# Altium project S7V30V2.PrjPCB (part 2 of 2)

## Sheet Shett_3.SchDoc
size A3
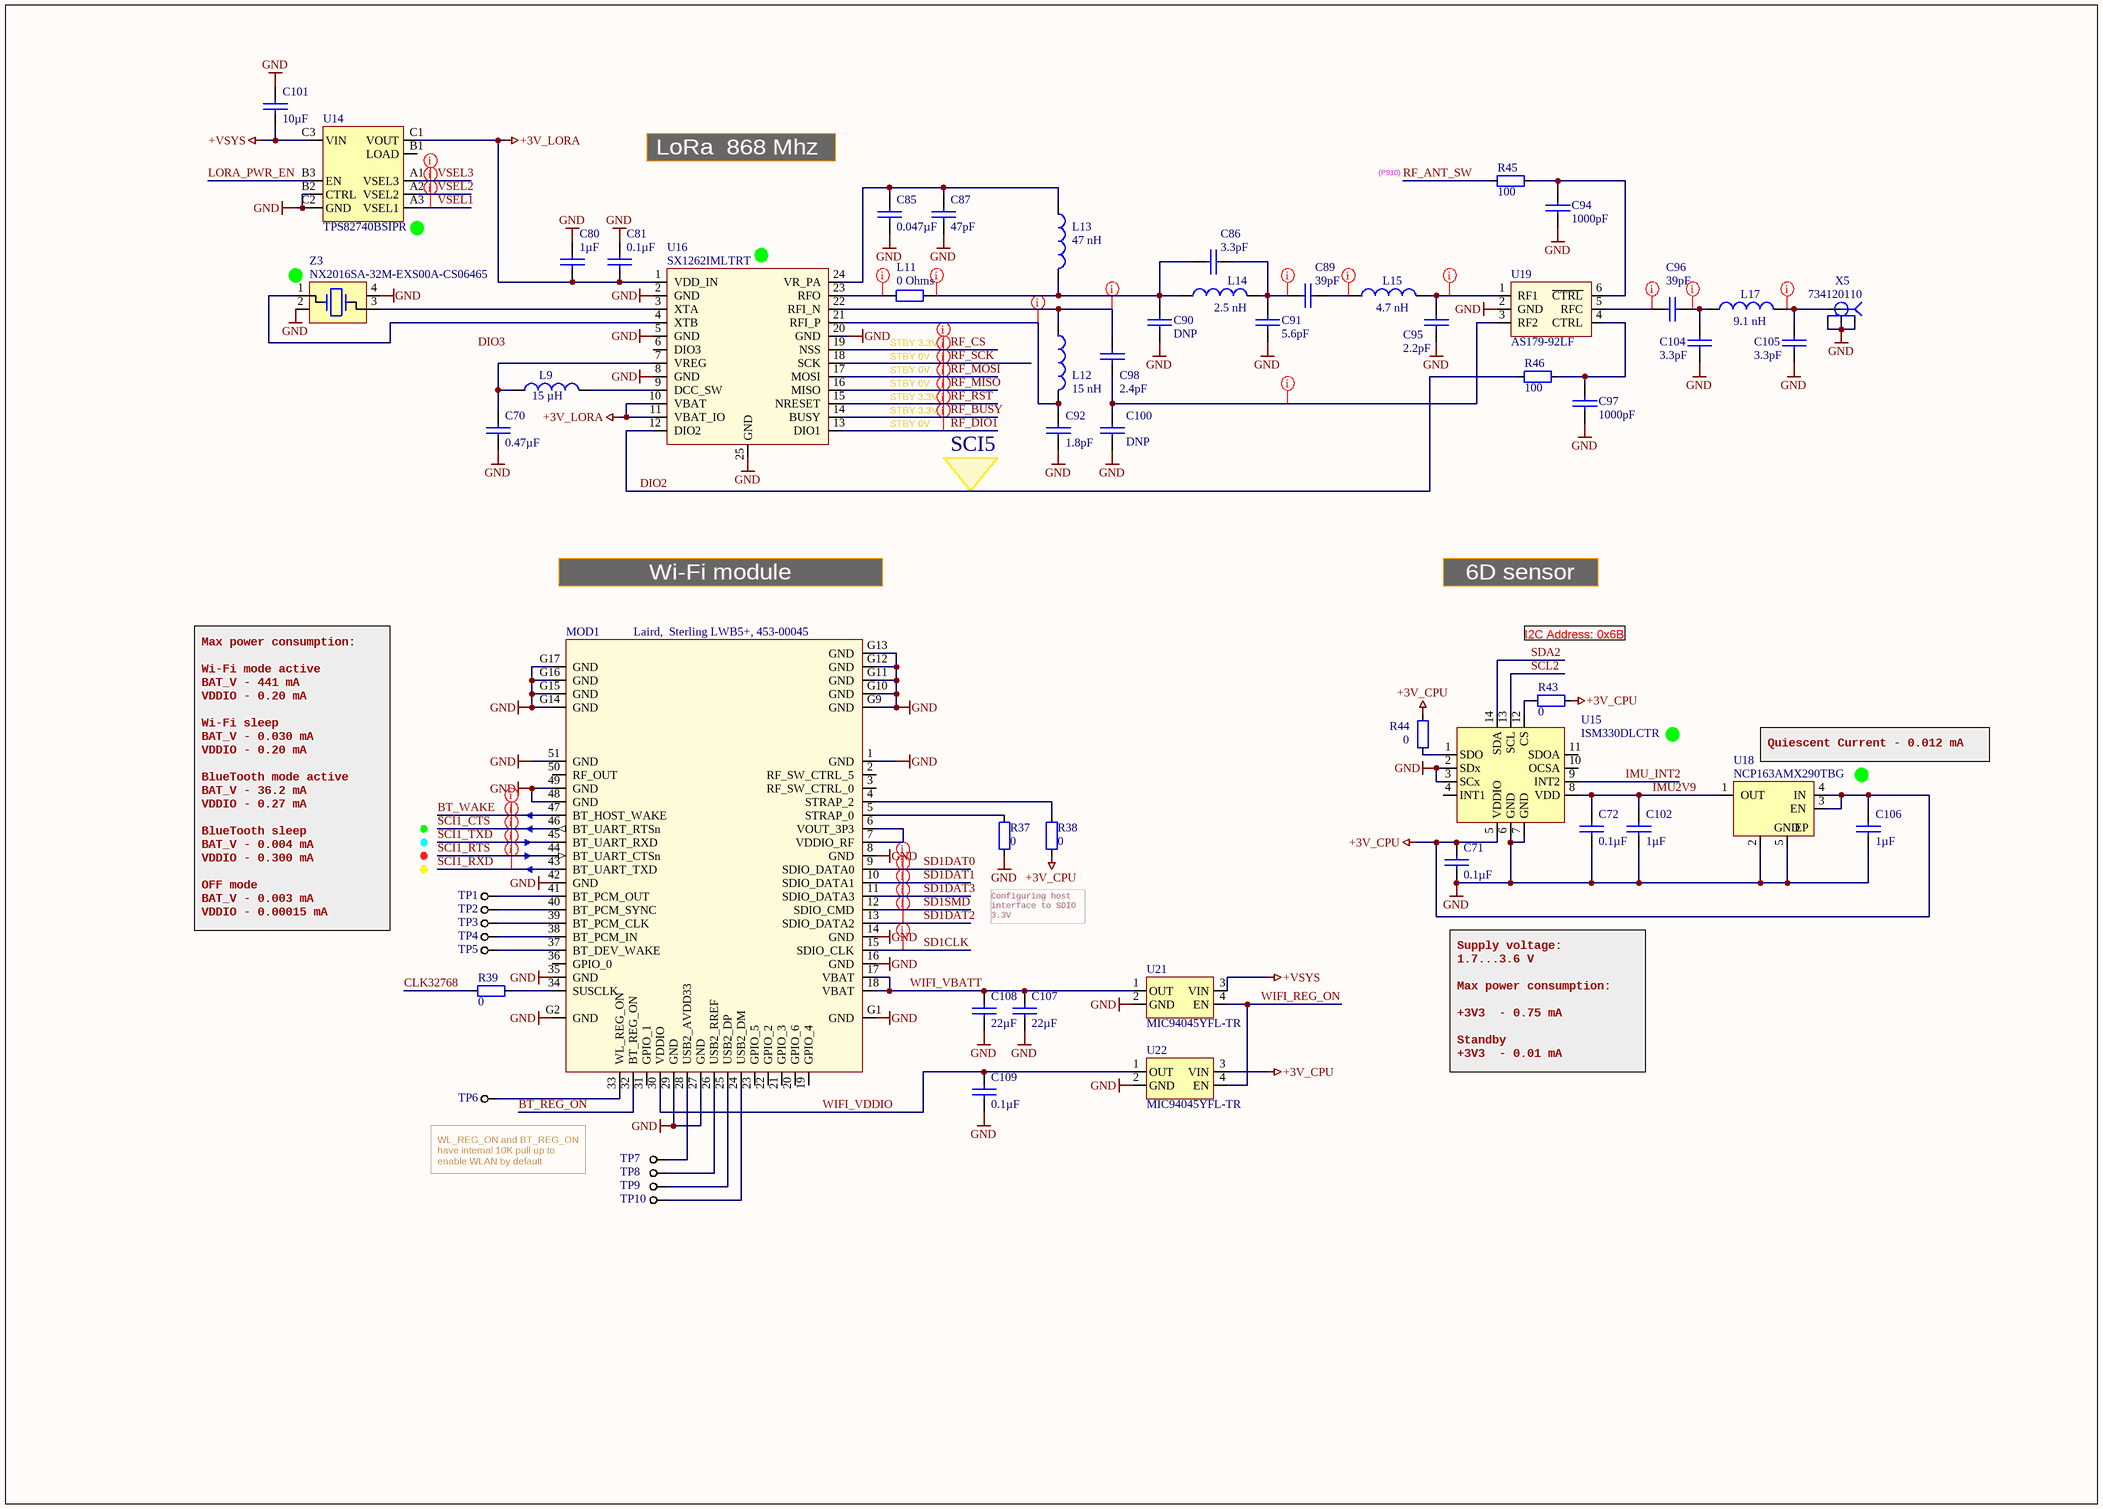
[diagram p2: Shett_3.SchDoc]

### Parts
C70  value 0.47µF  [0402 CAP]  (hidden comment: GRT155R61E474ME01D)
C71  value 0.1µF  [0402 CAP]  (hidden comment: 0402B104K500CT)
C72  value 0.1µF  [0402 CAP]  (hidden comment: 0402B104K500CT)
C80  value 1µF  [0402 CAP]  (hidden comment: TMK105BJ105MV-F)
C81  value 0.1µF  [0402 CAP]  (hidden comment: 0402B104K500CT)
C85  value 0.047µF  [0402 CAP]  (hidden comment: CC0402KRX7R8BB473)
C86  value 3.3pF  [0402 CAP]  (hidden comment: 885392005011)
C87  value 47pF  [0402 CAP]  (hidden comment: GJM1555C1H470FB01D)
C89  value 39pF  [0402 CAP]  (hidden comment: GJM1555C1H390JB01D)
C90  value DNP  [0402 CAP]  (hidden comment: Capacitor_0402)  (no BOM)
C91  value 5.6pF  [0402 CAP]  (hidden comment: GJM1555C1H5R6BB01D)
C92  value 1.8pF  [0402 CAP]  (hidden comment: GJM1555C1H1R8BB01D)
C94  value 1000pF  [0402 CAP]  (hidden comment: C1005CH1H102J050BA)
C95  value 2.2pF  [0402 CAP]  (hidden comment: CBR04C229B5GAC)
C96  value 39pF  [0402 CAP]  (hidden comment: GJM1555C1H390JB01D)
C97  value 1000pF  [0402 CAP]  (hidden comment: C1005CH1H102J050BA)
C98  value 2.4pF  [0402 CAP]  (hidden comment: GJM1555C1H2R4BB01D)
C100  value DNP  [0402 CAP]  (hidden comment: Capacitor_0402)  (no BOM)
C101  value 10µF  [0603 CAP]  (hidden comment: GRT188R61C106KE13D)
C102  value 1µF  [0402 CAP]  (hidden comment: TMK105BJ105MV-F)
C104  value 3.3pF  [0402 CAP]  (hidden comment: 885392005011)
C105  value 3.3pF  [0402 CAP]  (hidden comment: 885392005011)
C106  value 1µF  [0402 CAP]  (hidden comment: TMK105BJ105MV-F)
C107  value 22µF  [0603 CAP]  (hidden comment: LMK107BBJ226MA-T)
C108  value 22µF  [0603 CAP]  (hidden comment: LMK107BBJ226MA-T)
C109  value 0.1µF  [0402 CAP]  (hidden comment: 0402B104K500CT)
L9  value 15 µH  [2012[0805]]  (hidden comment: LQM21DH150M70L)
L11  value 0 Ohms  [INDC1005-0402]  (hidden comment: CRCW04020000Z0ED)
L12  value 15 nH  [INDC1005-0402]  (hidden comment: LQW15AN15NH00D)
L13  value 47 nH  [INDC1005-0402]  (hidden comment: LQW15AN47NJ00D)
L14  value 2.5 nH  [INDC1005-0402]  (hidden comment: LQW15AN2N5C00D)
L15  value 4.7 nH  [INDC1005-0402]  (hidden comment: LQW15AN4N7C00D)
L17  value 9.1 nH  [INDC1005-0402]  (hidden comment: LQW15AN9N1H00D)
MOD1  Laird,  Sterling LWB5+, 453-00045  [LWB5+ 453-00045C ver S7V30]
R37  value 0  [0402]  (hidden comment: WR04X000 PTL)
R38  value 0  [0402]  (hidden comment: WR04X000 PTL)
R39  value 0  [0402]  (hidden comment: WR04X000 PTL)
R43  value 0  [0402]  (hidden comment: WR04X000 PTL)
R44  value 0  [0402]  (hidden comment: WR04X000 PTL)
R45  value 100  [0402]  (hidden comment: RMCF0402FT100R)
R46  value 100  [0402]  (hidden comment: RMCF0402FT100R)
TP1  Test_point 0.5 мм  [Test point 0.5 мм]  (value not drawn)  (net tie, no BOM)
TP2  Test_point 0.5 мм  [Test point 0.5 мм]  (value not drawn)  (net tie, no BOM)
TP3  Test_point 0.5 мм  [Test point 0.5 мм]  (value not drawn)  (net tie, no BOM)
TP4  Test_point 0.5 мм  [Test point 0.5 мм]  (value not drawn)  (net tie, no BOM)
TP5  Test_point 0.5 мм  [Test point 0.5 мм]  (value not drawn)  (net tie, no BOM)
TP6  Test_point 0.5 мм  [Test point 0.5 мм]  (value not drawn)  (net tie, no BOM)
TP7  Test_point 0.5 мм  [Test point 0.5 мм]  (value not drawn)  (net tie, no BOM)
TP8  Test_point 0.5 мм  [Test point 0.5 мм]  (value not drawn)  (net tie, no BOM)
TP9  Test_point 0.5 мм  [Test point 0.5 мм]  (value not drawn)  (net tie, no BOM)
TP10  Test_point 0.5 мм  [Test point 0.5 мм]  (value not drawn)  (net tie, no BOM)
U14  TPS82740BSIPR  [MicroSiP]
U15  ISM330DLCTR  [LGA-14 BOSCH]
U16  SX1262IMLTRT  [VQFN24]
U18  NCP163AMX290TBG  [4-XDFN]
U19  AS179-92LF  [SC70-6]
U21  MIC94045YFL-TR  [4-WDFN]
U22  MIC94045YFL-TR  [4-WDFN]
X5  734120110  [0734120110]
Z3  NX2016SA-32M-EXS00A-CS06465  [4-SMD 2.00mm x 1.60mm]

### Nets
+3V_CPU: C71.1 C106.1 R38.1 R43.1 R44.2 U15.5(VDDIO) U18.3(EN) U18.4(IN) U22.3(VIN)
+3V_LORA: C80.2 C81.2 U14.C1(VOUT) U16.1(VDD_IN) U16.10(VBAT) U16.11(VBAT_IO)
+VSYS: C101.2 U14.C3(VIN) U21.3(VIN)
GND: C70.2 C71.2 C72.2 C80.1 C81.1 C85.2 C87.2 C90.2 C91.2 C92.2 C94.1 C95.2 C97.1 C100.2 C101.1 C102.2 C104.1 C105.1 C106.2 C107.2 C108.2 C109.2 MOD1.1(GND) MOD1.8(GND) MOD1.14(GND) MOD1.16(GND) MOD1.27(GND) MOD1.29(GND) MOD1.35(GND) MOD1.42(GND) MOD1.48(GND) MOD1.49(GND) MOD1.51(GND) MOD1.G1(GND) MOD1.G2(GND) MOD1.G9(GND) MOD1.G10(GND) MOD1.G11(GND) MOD1.G12(GND) MOD1.G13(GND) MOD1.G14(GND) MOD1.G15(GND) MOD1.G16(GND) MOD1.G17(GND) R37.1 U14.B2(CTRL) U14.C2(GND) U15.2(SDx) U15.3(SCx) U15.6(GND) U15.7(GND) U16.2(GND) U16.5(GND) U16.8(GND) U16.20(GND) U16.25(GND) U18.2(GND) U18.5(EP) U19.2(GND) U21.2(GND) U22.2(GND) X5.2 X5.3 X5.4 Z3.2 Z3.4
BT_REG_ON: MOD1.32(BT_REG_ON)
BT_WAKE: MOD1.47(BT_HOST_WAKE)
CLK32768: R39.2
DIO2: R46.2 U16.12(DIO2)
IMU2V9: C72.1 C102.1 U15.8(VDD) U18.1(OUT)
IMU_INT2: U15.9(INT2)
LORA_PWR_EN: U14.B3(EN)
RF_ANT_SW: R45.2
RF_BUSY: U16.14(BUSY)
RF_CS: U16.19(NSS)
RF_DIO1: U16.13(DIO1)
RF_MISO: U16.16(MISO)
RF_MOSI: U16.17(MOSI)
RF_RST: U16.15(NRESET)
RF_SCK: U16.18(SCK)
SCI1_CTS: MOD1.46(BT_UART_RTSn)
SCI1_RTS: MOD1.44(BT_UART_CTSn)
SCI1_RXD: MOD1.43(BT_UART_TXD)
SCI1_TXD: MOD1.45(BT_UART_RXD)
SCL2: U15.13(SCL)
SD1CLK: MOD1.15(SDIO_CLK)
SD1DAT0: MOD1.9(SDIO_DATA0)
SD1DAT1: MOD1.10(SDIO_DATA1)
SD1DAT2: MOD1.13(SDIO_DATA2)
SD1DAT3: MOD1.11(SDIO_DATA3)
SD1SMD: MOD1.12(SDIO_CMD)
SDA2: U15.14(SDA)
VSEL1: U14.A3(VSEL1)
VSEL2: U14.A2(VSEL2)
VSEL3: U14.A1(VSEL3)
WIFI_REG_ON: U21.4(EN) U22.4(EN)
WIFI_VBATT: C107.1 C108.1 MOD1.17(VBAT) MOD1.18(VBAT) U21.1(OUT)
WIFI_VDDIO: C109.1 MOD1.30(VDDIO) U22.1(OUT)
NetC70_1: C70.1 L9.1 U16.7(VREG)
NetC85_1: C85.1 C87.1 L13.1 U16.24(VR_PA)
NetC86_1: C86.1 C90.1 L11.2 L13.2 L14.1
NetC86_2: C86.2 C89.1 C91.1 L14.2
NetC89_2: C89.2 L15.1
NetC92_1: C92.1 L12.2 U16.21(RFI_P)
NetC94_2: C94.2 R45.1 U19.6(~{CTRL})
NetC95_1: C95.1 L15.2 U19.1(RF1)
NetC96_1: C96.1 U19.5(RFC)
NetC96_2: C96.2 C104.2 L17.1
NetC97_2: C97.2 R46.1 U19.4(CTRL)
NetC98_1: C98.1 L12.1 U16.22(RFI_N)
NetC98_2: C98.2 C100.1 U19.3(RF2)
NetC105_2: C105.2 L17.2 X5.1(Sig)
NetL9_2: L9.2 U16.9(DCC_SW)
NetL11_1: L11.1 U16.23(RFO)
NetMOD1_4: MOD1.4(STRAP_2) R38.2
NetMOD1_5: MOD1.5(STRAP_0) R37.2
NetMOD1_6: MOD1.6(VOUT_3P3) MOD1.7(VDDIO_RF)
NetMOD1_24: MOD1.24(USB2_DM) TP10.1
NetMOD1_25: MOD1.25(USB2_DP) TP9.1
NetMOD1_26: MOD1.26(USB2_RREF) TP8.1
NetMOD1_28: MOD1.28(USB2_AVDD33) TP7.1
NetMOD1_33: MOD1.33(WL_REG_ON) TP6.1
NetMOD1_34: MOD1.34(SUSCLK) R39.1
NetMOD1_37: MOD1.37(BT_DEV_WAKE) TP5.1
NetMOD1_38: MOD1.38(BT_PCM_IN) TP4.1
NetMOD1_39: MOD1.39(BT_PCM_CLK) TP3.1
NetMOD1_40: MOD1.40(BT_PCM_SYNC) TP2.1
NetMOD1_41: MOD1.41(BT_PCM_OUT) TP1.1
NetR43_2: R43.2 U15.12(CS)
NetR44_1: R44.1 U15.1(SDO)
NetU16_3: U16.3(XTA) Z3.3
NetU16_4: U16.4(XTB) Z3.1

Not connected (* = marked no-connect by the designer): MOD1 2(RF_SW_CTRL_5) 3(RF_SW_CTRL_0) 19(GPIO_4) 20(GPIO_6) 21(GPIO_3) 22(GPIO_2) 23(GPIO_5) 31(GPIO_1) 36(GPIO_0) 50(RF_OUT); U14 B1(LOAD); U15 4(INT1) 10(OCSA) 11(SDOA); U16 6(DIO3)

### Layout directives
net class RF: NetC86_1, NetC86_2, NetC89_2, NetC92_1, NetC95_1, NetC96_1, NetC96_2, NetC98_1, NetC98_2, NetC105_2, NetL11_1
net class VSEL: VSEL1, VSEL2, VSEL3
net class LoRa: RF_BUSY, RF_CS, RF_DIO1, RF_MISO, RF_MOSI, RF_RST, RF_SCK
net class SDIO: SD1CLK, SD1DAT0, SD1DAT1, SD1DAT2, SD1DAT3, SD1SMD
net class CSI1: BT_WAKE, SCI1_CTS, SCI1_RTS, SCI1_RXD, SCI1_TXD

### Notes on the sheet
- LoRa  868 Mhz
- (P910)
- STBY 0V
- STBY 3.3V
- SCI5
- Wi-Fi module
- 6D sensor
- I2C Address: 0x6B
- (near U18) Quiescent Current - 0.012 mA
- Configuring host interface to SDIO 3.3V
- Max power consumption:
  Wi-Fi mode active
  BAT_V - 441 mA
  VDDIO - 0.20 mA
  Wi-Fi sleep
  BAT_V - 0.030 mA
  VDDIO - 0.20 mA
  BlueTooth mode active
  BAT_V - 36.2 mA
  VDDIO - 0.27 mA
  BlueTooth sleep
  BAT_V - 0.004 mA
  VDDIO - 0.300 mA
  OFF mode
  BAT_V - 0.003 mA
  VDDIO - 0.00015 mA
- Supply voltage:
  1.7...3.6 V
  Max power consumption:
  +3V3  - 0.75 mA
  Standby
  +3V3  - 0.01 mA
- (near TP6) WL_REG_ON and BT_REG_ON have internal 10K pull-up to enable WLAN by default
- Labels drawn without touching a wire or pin: DIO3

### Library data of the parts
C70 = GRT155R61E474ME01D: 0.47µF, ±20%, 25V, X5R, 0402 (1005 Metric), -55°C ~ 85°C, -, Automotive; Manufacturer: Murata Electronics North America; PartNum: 490-12270-1-ND; Voltage - Rated: 25V; Part Number: GRT155R61E474ME01D; Distributor: Digi-Key; PartName: GRT155R61E474ME01D; Price: 0.13000; Tolerance: ±20%; Temperature Coefficient: X5R; Operating Temperature: -55°C ~ 85°C; Features: -; Package / Case: 0402 (1005 Metric)
C71 C72 C81 C109 = 0402B104K500CT: as C3 on sheet Sheet_2; Voltage - Rated: 50V; Part Number: 0402B104K500CT; Distributor: Digi-Key; PartName: 0402B104K500CT; Price: 0.19000; Tolerance: ±10%; Temperature Coefficient: X7R; Operating Temperature: -55°C ~ 125°C; Features: -; Package / Case: 0402 (1005 Metric)
C80 C102 C106 = TMK105BJ105MV-F: 1µF, ±20%, 25V, X5R, 0402 (1005 Metric), -55°C ~ 85°C, -, General Purpose; Manufacturer: Taiyo Yuden; PartNum: 587-3245-1-ND; Voltage - Rated: 25V; Part Number: TMK105BJ105MV-F; Distributor: Digi-Key; PartName: TMK105BJ105MV-F; Price: 0.22000; Tolerance: ±20%; Temperature Coefficient: X5R; Operating Temperature: -55°C ~ 85°C; Features: -; Package / Case: 0402 (1005 Metric)
C85 = CC0402KRX7R8BB473: 0.047µF, ±10%, 25V, X7R, 0402 (1005 Metric), -55°C ~ 125°C, -, General Purpose; Manufacturer: Yageo; PartNum: 311-1717-1-ND; Voltage - Rated: 25V; Part Number: CC0402KRX7R8BB473; Distributor: Digi-Key; PartName: CC0402KRX7R8BB473; Price: 0.10000; Tolerance: ±10%; Temperature Coefficient: X7R; Operating Temperature: -55°C ~ 125°C; Features: -; Package / Case: 0402 (1005 Metric)
C86 C104 C105 = 885392005011: 3.3pF, ±0.1pF, 50V, C0G, NP0, 0402 (1005 Metric), -55°C ~ 125°C, -, RF, Microwave, High Frequency; Manufacturer: Wurth Electronics Inc.; PartNum: 732-13236-1-ND; Voltage - Rated: 50V; Part Number: 885392005011; Distributor: Digi-Key; PartName: 885392005011; Price: 0.10000; Tolerance: ±0.1pF; Temperature Coefficient: C0G, NP0; Operating Temperature: -55°C ~ 125°C; Features: -; Package / Case: 0402 (1005 Metric)
C87 = GJM1555C1H470FB01D: 47pF, ±1%, 50V, C0G, NP0, 0402 (1005 Metric), -55°C ~ 125°C, High Q, Low Loss, RF, Microwave, High Frequency; Manufacturer: Murata Electronics North America; PartNum: 490-16376-1-ND; Voltage - Rated: 50V; Part Number: GJM1555C1H470FB01D; Distributor: Digi-Key; PartName: GJM1555C1H470FB01D; Price: 0.28000; Tolerance: ±1%; Temperature Coefficient: C0G, NP0; Operating Temperature: -55°C ~ 125°C; Features: High Q, Low Loss; Package / Case: 0402 (1005 Metric)
C89 C96 = GJM1555C1H390JB01D: 39pF, ±5%, 50V, C0G, NP0, 0402 (1005 Metric), -55°C ~ 125°C, High Q, Low Loss, RF, Microwave, High Frequency; Manufacturer: Murata Electronics North America; PartNum: 490-17673-1-ND; Voltage - Rated: 50V; Part Number: GJM1555C1H390JB01D; Distributor: Digi-Key; PartName: GJM1555C1H390JB01D; Price: 0.24000; Tolerance: ±5%; Temperature Coefficient: C0G, NP0; Operating Temperature: -55°C ~ 125°C; Features: High Q, Low Loss; Package / Case: 0402 (1005 Metric)
C91 = GJM1555C1H5R6BB01D: 5.6pF, ±0.1pF, 50V, C0G, NP0, 0402 (1005 Metric), -55°C ~ 125°C, High Q, Low Loss, RF, Microwave, High Frequency; Manufacturer: Murata Electronics North America; PartNum: 490-11225-1-ND; Voltage - Rated: 50V; Part Number: GJM1555C1H5R6BB01D; Distributor: Digi-Key; PartName: GJM1555C1H5R6BB01D; Price: 0.19000; Tolerance: ±0.1pF; Temperature Coefficient: C0G, NP0; Operating Temperature: -55°C ~ 125°C; Features: High Q, Low Loss; Package / Case: 0402 (1005 Metric)
C92 = GJM1555C1H1R8BB01D: 1.8pF, ±0.1pF, 50V, C0G, NP0, 0402 (1005 Metric), -55°C ~ 125°C, High Q, Low Loss, RF, Microwave, High Frequency; Manufacturer: Murata Electronics North America; PartNum: 490-8089-1-ND; Voltage - Rated: 50V; Part Number: GJM1555C1H1R8BB01D; Distributor: Digi-Key; PartName: GJM1555C1H1R8BB01D; Price: 0.19000; Tolerance: ±0.1pF; Temperature Coefficient: C0G, NP0; Operating Temperature: -55°C ~ 125°C; Features: High Q, Low Loss; Package / Case: 0402 (1005 Metric)
C94 C97 = C1005CH1H102J050BA: 1000pF, ±5%, 50V, CH, 0402 (1005 Metric), -25°C ~ 85°C, Low ESL, General Purpose; Manufacturer: TDK Corporation; PartNum: 445-10829-1-ND; Voltage - Rated: 50V; Part Number: C1005CH1H102J050BA; Distributor: Digi-Key; PartName: C1005CH1H102J050BA; Price: 0.19000; Tolerance: ±5%; Temperature Coefficient: CH; Operating Temperature: -25°C ~ 85°C; Features: Low ESL; Package / Case: 0402 (1005 Metric)
C95 = CBR04C229B5GAC: 2.2pF, ±0.1pF, 50V, C0G, NP0, 0402 (1005 Metric), -55°C ~ 125°C, High Q, Low Loss, RF, Microwave, High Frequency; Manufacturer: KEMET; PartNum: 399-17527-1-ND; Voltage - Rated: 50V; Part Number: CBR04C229B5GAC; Distributor: Digi-Key; PartName: CBR04C229B5GAC; Price: 0.19000; Tolerance: ±0.1pF; Temperature Coefficient: C0G, NP0; Operating Temperature: -55°C ~ 125°C; Features: High Q, Low Loss; Package / Case: 0402 (1005 Metric)
C98 = GJM1555C1H2R4BB01D: 2.4pF, ±0.1pF, 50V, C0G, NP0, 0402 (1005 Metric), -55°C ~ 125°C, High Q, Low Loss, RF, Microwave, High Frequency; Manufacturer: Murata Electronics North America; PartNum: 490-8093-1-ND; Voltage - Rated: 50V; Part Number: GJM1555C1H2R4BB01D; Distributor: Digi-Key; PartName: GJM1555C1H2R4BB01D; Price: 0.19000; Tolerance: ±0.1pF; Temperature Coefficient: C0G, NP0; Operating Temperature: -55°C ~ 125°C; Features: High Q, Low Loss; Package / Case: 0402 (1005 Metric)
C101 = GRT188R61C106KE13D: as C1 on sheet Sheet_2; Voltage - Rated: 16V; Part Number: GRT188R61C106KE13D; Distributor: Digi-Key; PartName: GRT188R61C106KE13D; Price: 0.22770; Tolerance: ±10%; Temperature Coefficient: X5R; Operating Temperature: -55°C ~ 85°C; Features: -; Package / Case: 0603 (1608 Metric)
C107 C108 = LMK107BBJ226MA-T: 22µF, ±20%, 10V, X5R, 0603 (1608 Metric), -55°C ~ 85°C, -, SMPS Filtering; Manufacturer: Taiyo Yuden; PartNum: 587-4913-1-ND; Part Number: LMK107BBJ226MA-T; Distributor: Digi-Key; PartName: LMK107BBJ226MA-T; Price: 0.25810; Tolerance: ±20%; Voltage - Rated: 10V; Temperature Coefficient: X5R; Operating Temperature: -55°C ~ 85°C; Features: -; Package / Case: 0603 (1608 Metric)
L9 = LQM21DH150M70L: 15 µH Shielded Multilayer Inductor 250 mA, 1.235Ohm, 24MHz Max 0805 (2012 Metric); Manufacturer: Murata Electronics; PartNum: 490-LQM21DH150M70LCT-ND; Tolerance: ±20%; Distributor: Digi-Key; Price: 0.16$; PartName: LQM21DH150M70L
L11 = CRCW04020000Z0ED: 0 Ohms Jumper 0.063W, 1/16W Chip Resistor 0402 (1005 Metric) Automotive AEC-Q200 Thick Film; Manufacturer: Vishay Dale; PartNum: 541-0.0JCT-ND; Distributor: Digi-Key; PartName: CRCW04020000Z0ED
L12 = LQW15AN15NH00D: 15nH Unshielded Wirewound Inductor 460mA 160 mOhm Max 0402 (1006 Metric); Manufacturer: Murata; PartNum: 490-6772-1-ND; Tolerance: ±3%; Distributor: Digi-Key; PartName: LQW15AN15NH00D
L13 = LQW15AN47NJ00D: 47nH Unshielded Wirewound Inductor 210mA 1.08 Ohm Max 0402 (1005 Metric); Manufacturer: Murata; PartNum: 490-1154-1-ND; Tolerance: ±5%; Distributor: Digi-Key; PartName: LQW15AN47NJ00D
L14 = LQW15AN2N5C00D: 2.5nH Unshielded Wirewound Inductor 850mA 50 mOhm Max 0402 (1006 Metric); Manufacturer: Murata; PartNum: 490-6798-1-ND; Tolerance: ±0.2nH; Distributor: Digi-Key; PartName: LQW15AN2N5C00D
L15 = LQW15AN4N7C00D: 4.7nH Unshielded Wirewound Inductor 750mA 70 mOhm Max 0402 (1006 Metric); Manufacturer: Murata Electronics North America; PartNum: 490-1139-1-ND; Tolerance: ±0.2nH; Distributor: Digi-Key; PartName: LQW15AN4N7C00D
L17 = LQW15AN9N1H00D: 9.1nH Unshielded Wirewound Inductor 540mA 140 mOhm Max 0402 (1006 Metric); Manufacturer: Murata Electronics North America; PartNum: 490-8444-1-ND; Tolerance: ±3%; Distributor: Digi-Key; PartName: LQW15AN9N1H00D
MOD1 = CMP-MOD-453-00012-1.4_ver_S7V30: Module, Sterling LWB5+; Substitutes Allowed: NO; Footprint: Laird, Sterling LWB5+ Module, Platform Size; Mounting: SMT; Operating Temperature: -40°C ~ +85°C; Manufacturer: Laird
R37-R39 R43 R44 = WR04X000 PTL: 0 Ohms Jumper 0.063W, 1/16W Chip Resistor 0402 (1005 Metric) Thick Film; Manufacturer: Walsin Technology Corporation; PartNum: 1292-WR04X000PTLCT-ND; Voltage: 50 V; Distributor: Digi-Key; Price: 0.002$; PartName: WR04X000 PTL
R45 R46 = RMCF0402FT100R: 100 Ohms, ±1%, 0.063W, 1/16W, Thick Film, ±100ppm/°C, 0402 (1005 Metric), -55°C ~ 155°C, Automotive AEC-Q200; Manufacturer: Stackpole Electronics Inc; PartNum: RMCF0402FT100RCT-ND; Voltage: 75V; Distributor: Digi-Key; Price: 0.10000; Tolerance: ±1%; PartName: RMCF0402FT100R; Part Number: RMCF0402FT100R; Temperature Coefficient: ±100ppm/°C; Operating Temperature: -55°C ~ 155°C; Power (Watts): 0.063W, 1/16W; Features: Automotive AEC-Q200; Package / Case: 0402 (1005 Metric)
U14 = TPS82740BSIPR: Non-Isolated PoL Module DC DC Converter 1 Output 2.6 ~ 3.3V 200mA 2.2V - 5.5V Input, 3.0mm x 2.4mm x 1.0mm, -40...85 C; Manufacturer: Texas Instruments; PartNum: 296-46481-1-ND; Distributor: Digi-Key; price: 2.88$; PartName: TPS82740BSIPR
U15 = ISM330DLCTR: Accelerometer, Gyroscope, Temperature, 3 Axis Sensor I²C, SPI , -40°C ~ 85°C, 14-LGA (2.5x3); Manufacturer: STMicroelectronics; PartNum: 497-17583-1-ND; Price: 6.28$; Distributor: Digi-Key; PartName: ISM330DLCTR
U16 = SX1262IMLTRT: IC RF TxRx Only General ISM < 1GHz LoRaWAN 150MHz ~ 960MHz 24-VFQFN Exposed Pad; Manufacturer: Semtech Corporation; PartName: SX1262IMLTRTCT-ND; Distributor: Digi-Key; PartNum: SX1262IMLTRT; Price: 7.94$
U18 = NCP163AMX290TBG: LDO 2.9V, 250 mA, Vin < 5.5V, Iq < 20uA, PSSR 91dB ~ 60dB, -40..+125 C,  4-XDFN (1x1); Manufacturer: ON Semiconductor; PartNum: NCP163AMX290TBGOSCT-ND; Price: 0.41$; Distributor: Digi-Key; PartName: NCP163AMX290TBG
U19 = AS179-92LF: RF Switch IC 802.11b, g, Bluetooth, WLAN SPDT 3 GHz 50Ohm SC-70-6, -40°C ~ 85°C; Manufacturer: Skyworks Solutions Inc.; PartNum: 863-1003-1-ND; Distributor: Digi-Key; PartName: AS179-92LF
U21 U22 = MIC94045YFL-TR: Power Switch P-Channel, 1.7V ~ 5.5V, 3A, 28 mOhm,   4-MLF® (1.2x1.2), -40...125 C; Manufacturer: Microchip Technology; PartNum: 576-3973-1-ND; Distributor: Digi-Key; price: 067$; PartName: MIC94045YFL-TR
X5 = 0734120110: U.FL (UMCC) Connector Receptacle, Male Pin 50 Ohm Surface Mount Solder; Manufacturer: Molex; PartNum: WM5587TR-ND; Distributor: Digi-Key; PartName: 0734120110
Z3 = NX2016SA-32M-EXS00A-CS06465: 32 MHz Crystal 10pF,  60 Ohms, 10 ppm,  4-SMD, No Lead, -40...+85 С; Manufacturer: NDK America, Inc.; PartNum: 644-1300-1-ND; Tolerance: ±1ppm; Value: 32 MHz; Distributor: Digi-Key; Price: 0.38$; PartName: NX2016SA-32M-EXS00A-CS06465

## Sheet Sheet_4.SchDoc
size A3
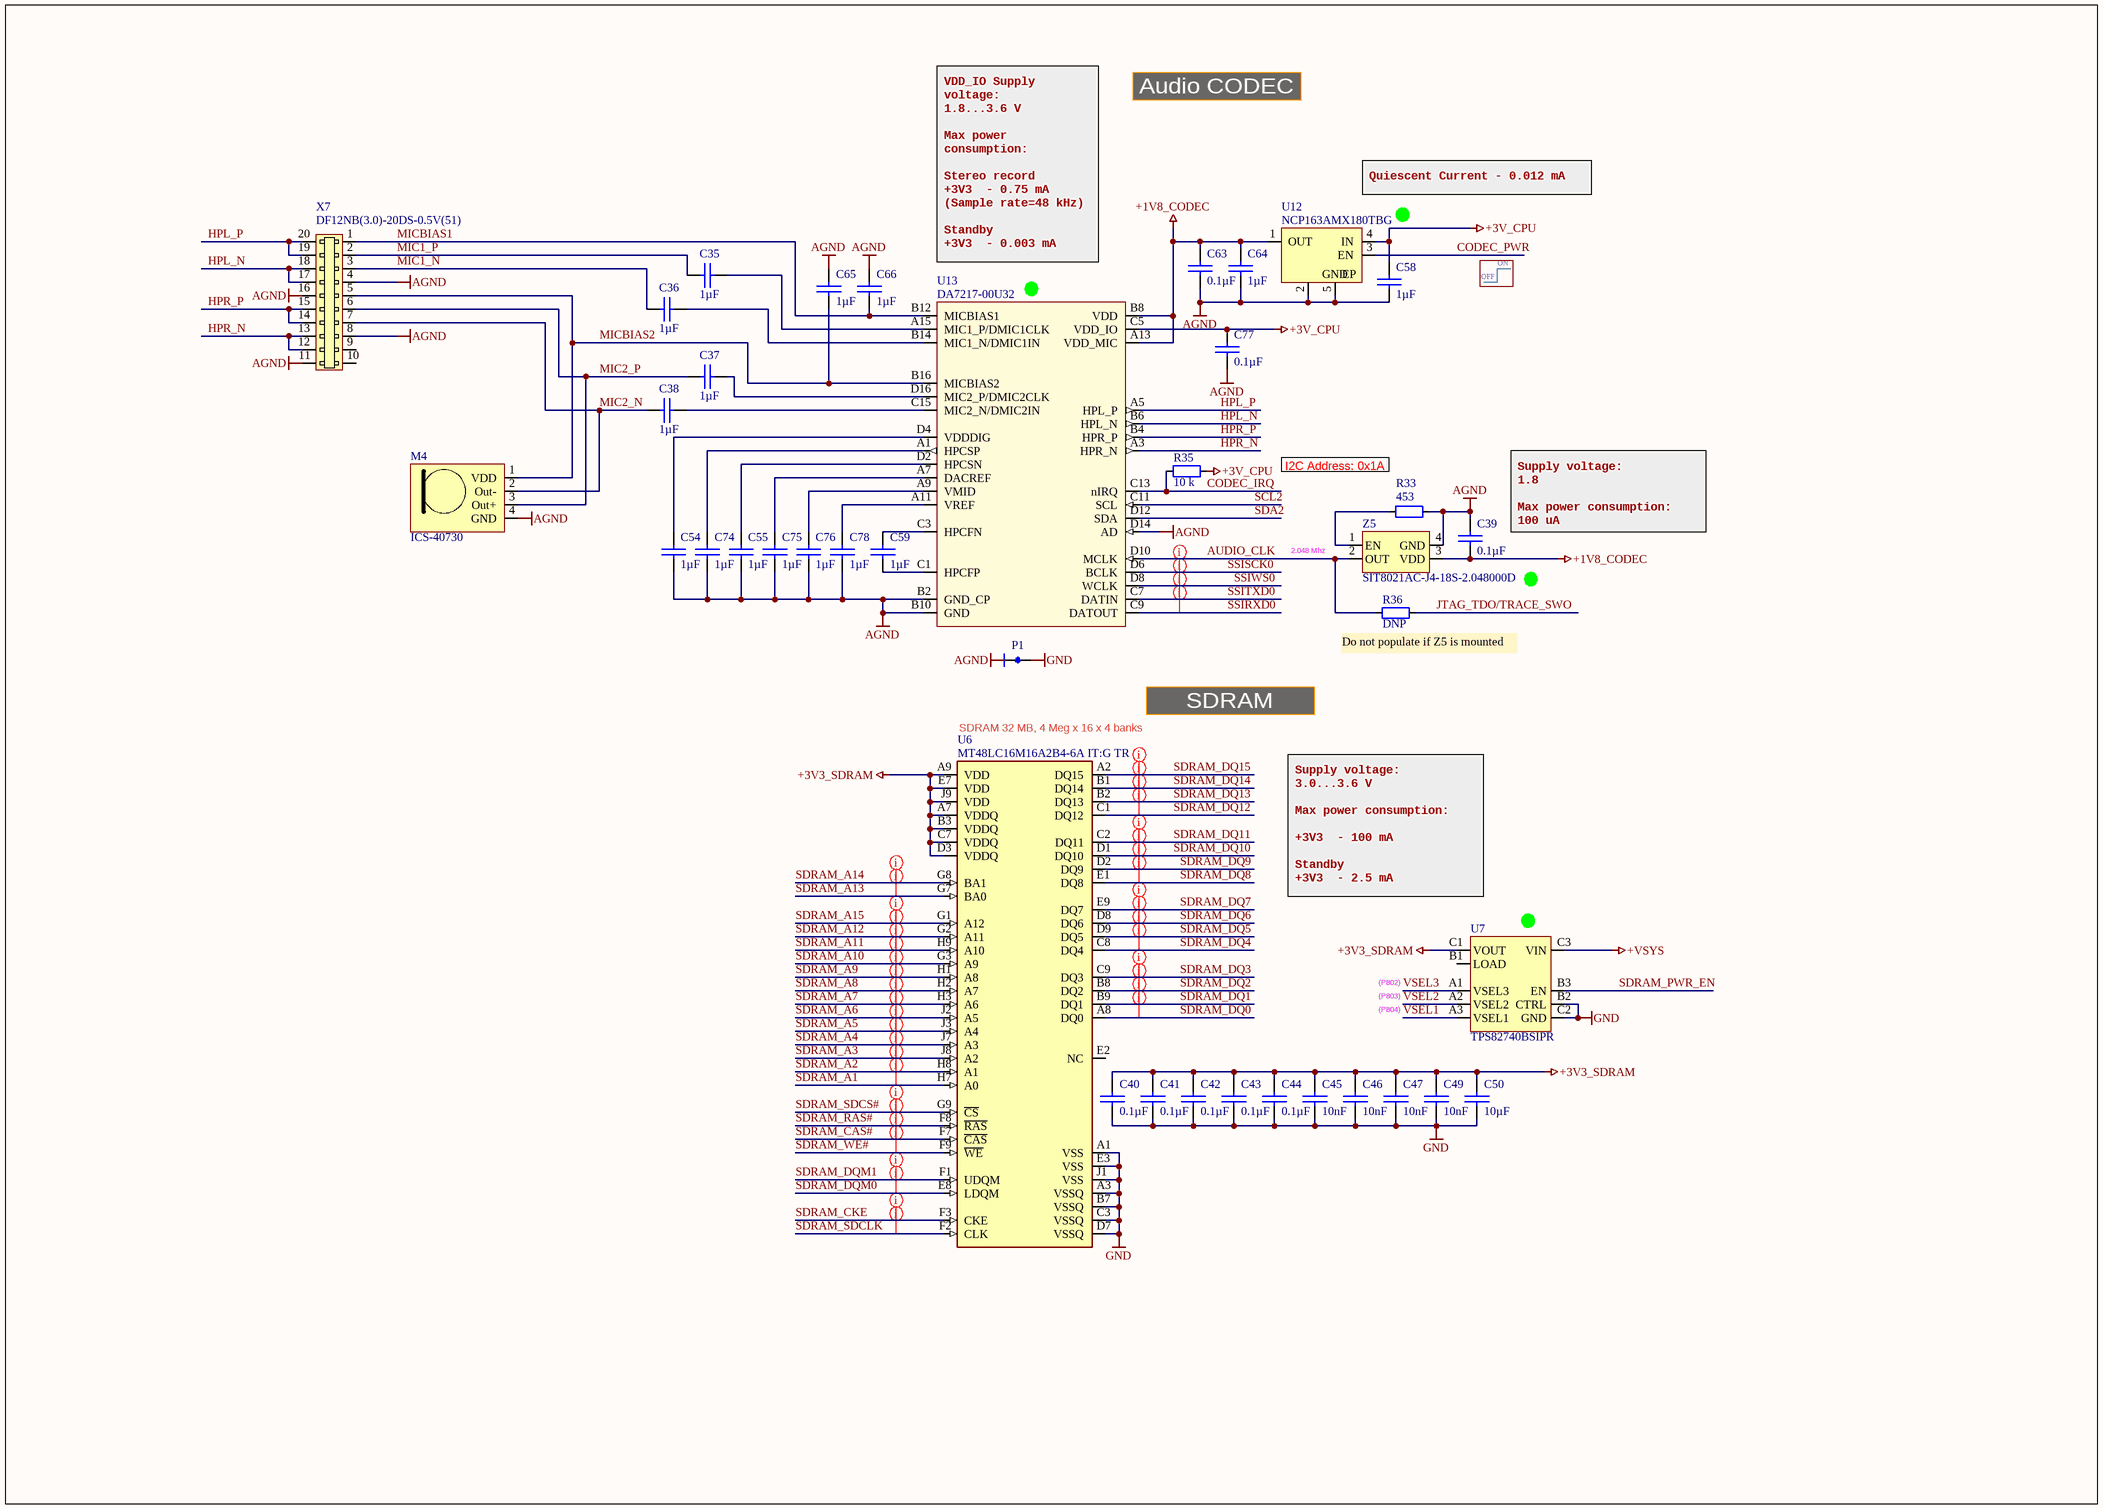
[diagram p3: Sheet_4.SchDoc]

### Parts
C35  value 1µF  [0402 CAP]  (hidden comment: TMK105BJ105MV-F)
C36  value 1µF  [0402 CAP]  (hidden comment: TMK105BJ105MV-F)
C37  value 1µF  [0402 CAP]  (hidden comment: TMK105BJ105MV-F)
C38  value 1µF  [0402 CAP]  (hidden comment: TMK105BJ105MV-F)
C39  value 0.1µF  [0402 CAP]  (hidden comment: 0402B104K500CT)
C40  value 0.1µF  [0402 CAP]  (hidden comment: 0402B104K500CT)
C41  value 0.1µF  [0402 CAP]  (hidden comment: 0402B104K500CT)
C42  value 0.1µF  [0402 CAP]  (hidden comment: 0402B104K500CT)
C43  value 0.1µF  [0402 CAP]  (hidden comment: 0402B104K500CT)
C44  value 0.1µF  [0402 CAP]  (hidden comment: 0402B104K500CT)
C45  value 10nF  [0402 CAP]  (hidden comment: CL05B103KB5NNNC)
C46  value 10nF  [0402 CAP]  (hidden comment: CL05B103KB5NNNC)
C47  value 10nF  [0402 CAP]  (hidden comment: CL05B103KB5NNNC)
C49  value 10nF  [0402 CAP]  (hidden comment: CL05B103KB5NNNC)
C50  value 10µF  [0603 CAP]  (hidden comment: GRT188R61C106KE13D)
C54  value 1µF  [0402 CAP]  (hidden comment: TMK105BJ105MV-F)
C55  value 1µF  [0402 CAP]  (hidden comment: TMK105BJ105MV-F)
C58  value 1µF  [0402 CAP]  (hidden comment: TMK105BJ105MV-F)
C59  value 1µF  [0402 CAP]  (hidden comment: TMK105BJ105MV-F)
C63  value 0.1µF  [0402 CAP]  (hidden comment: 0402B104K500CT)
C64  value 1µF  [0402 CAP]  (hidden comment: TMK105BJ105MV-F)
C65  value 1µF  [0402 CAP]  (hidden comment: TMK105BJ105MV-F)
C66  value 1µF  [0402 CAP]  (hidden comment: TMK105BJ105MV-F)
C74  value 1µF  [0402 CAP]  (hidden comment: TMK105BJ105MV-F)
C75  value 1µF  [0402 CAP]  (hidden comment: TMK105BJ105MV-F)
C76  value 1µF  [0402 CAP]  (hidden comment: TMK105BJ105MV-F)
C77  value 0.1µF  [0402 CAP]  (hidden comment: 0402B104K500CT)
C78  value 1µF  [0402 CAP]  (hidden comment: TMK105BJ105MV-F)
M4  ICS-40730  [ICS-40730]
P1  Net tie 0.1mm  [Net tee 0.1 mm]  (value not drawn)  (net tie, no BOM)
R33  value 453  [0402]  (hidden comment: RMCF0402FT453R)
R35  value 10 k  [0402]  (hidden comment: RMCF0402FT10K0)
R36  value DNP  [0402]  (hidden comment: Resistor)  (no BOM)
U6  MT48LC16M16A2B4-6A IT:G TR  [MICRON_VFBGA54]
U7  TPS82740BSIPR  [MicroSiP]
U12  NCP163AMX180TBG  [4-XDFN]
U13  DA7217-00U32  [Dilaog 34-WLCSP (4.57x1.98)]
X7  DF12NB(3.0)-20DS-0.5V(51)  [DF12NB(3.0)-20DS-0.5V(51)]
Z5  SIT8021AC-J4-18S-2.048000D  [SiT8021]

### Nets
+1V8_CODEC: C39.2 C63.1 C64.1 U12.1(OUT) U13.A13(VDD_MIC) U13.B8(VDD) Z5.3(VDD)
+3V3_SDRAM: C40.1 C41.1 C42.1 C43.1 C44.1 C45.1 C46.1 C47.1 C49.1 C50.1 U6.A7(VDDQ) U6.A9(VDD) U6.B3(VDDQ) U6.C7(VDDQ) U6.D3(VDDQ) U6.E7(VDD) U6.J9(VDD) U7.C1(VOUT)
+3V_CPU: C58.1 C77.1 R35.2 U12.4(IN) U13.C5(VDD_IO)
+VSYS: U7.C3(VIN)
AGND: C39.1 C54.2 C55.2 C58.2 C63.2 C64.2 C65.1 C66.1 C74.2 C75.2 C76.2 C77.2 C78.2 M4.4(GND) P1.1 R33.1 U12.2(GND) U12.5(EP) U13.B2(GND_CP) U13.B10(GND) U13.D14(AD) X7.4 X7.8 X7.11 X7.16 Z5.4(GND)
GND: C40.2 C41.2 C42.2 C43.2 C44.2 C45.2 C46.2 C47.2 C49.2 C50.2 P1.2 U6.A1(VSS) U6.A3(VSSQ) U6.B7(VSSQ) U6.C3(VSSQ) U6.D7(VSSQ) U6.E3(VSS) U6.J1(VSS) U7.B2(CTRL) U7.C2(GND)
AUDIO_CLK: R36.2 U13.D10(MCLK) Z5.2(OUT)
CODEC_IRQ: R35.1 U13.C13(nIRQ)
CODEC_PWR: U12.3(EN)
HPL_N: U13.B6(HPL_N) X7.17 X7.18
HPL_P: U13.A5(HPL_P) X7.19 X7.20
HPR_N: U13.A3(HPR_N) X7.12 X7.13
HPR_P: U13.B4(HPR_P) X7.14 X7.15
JTAG_TDO/TRACE_SWO: R36.1
MIC1_N: C36.1 X7.3
MIC1_P: C35.1 X7.2
MIC2_N: C38.1 M4.2(Out-) X7.7
MIC2_P: C37.1 M4.3(Out+) X7.6
MICBIAS1: C66.2 U13.B12(MICBIAS1) X7.1
MICBIAS2: C65.2 M4.1(VDD) U13.B16(MICBIAS2) X7.5
SCL2: U13.C11(SCL)
SDA2: U13.D12(SDA)
SDRAM_A1: U6.H7(A0)
SDRAM_A2: U6.H8(A1)
SDRAM_A3: U6.J8(A2)
SDRAM_A4: U6.J7(A3)
SDRAM_A5: U6.J3(A4)
SDRAM_A6: U6.J2(A5)
SDRAM_A7: U6.H3(A6)
SDRAM_A8: U6.H2(A7)
SDRAM_A9: U6.H1(A8)
SDRAM_A10: U6.G3(A9)
SDRAM_A11: U6.H9(A10)
SDRAM_A12: U6.G2(A11)
SDRAM_A13: U6.G7(BA0)
SDRAM_A14: U6.G8(BA1)
SDRAM_A15: U6.G1(A12)
SDRAM_CAS#: U6.F7(~{CAS})
SDRAM_CKE: U6.F3(CKE)
SDRAM_DQ0: U6.A8(DQ0)
SDRAM_DQ1: U6.B9(DQ1)
SDRAM_DQ2: U6.B8(DQ2)
SDRAM_DQ3: U6.C9(DQ3)
SDRAM_DQ4: U6.C8(DQ4)
SDRAM_DQ5: U6.D9(DQ5)
SDRAM_DQ6: U6.D8(DQ6)
SDRAM_DQ7: U6.E9(DQ7)
SDRAM_DQ8: U6.E1(DQ8)
SDRAM_DQ9: U6.D2(DQ9)
SDRAM_DQ10: U6.D1(DQ10)
SDRAM_DQ11: U6.C2(DQ11)
SDRAM_DQ12: U6.C1(DQ12)
SDRAM_DQ13: U6.B2(DQ13)
SDRAM_DQ14: U6.B1(DQ14)
SDRAM_DQ15: U6.A2(DQ15)
SDRAM_DQM0: U6.E8(LDQM)
SDRAM_DQM1: U6.F1(UDQM)
SDRAM_PWR_EN: U7.B3(EN)
SDRAM_RAS#: U6.F8(~{RAS})
SDRAM_SDCLK: U6.F2(CLK)
SDRAM_SDCS#: U6.G9(~{CS})
SDRAM_WE#: U6.F9(~{WE})
SSIRXD0: U13.C9(DATOUT)
SSISCK0: U13.D6(BCLK)
SSITXD0: U13.C7(DATIN)
SSIWS0: U13.D8(WCLK)
VSEL1: U7.A3(VSEL1)
VSEL2: U7.A2(VSEL2)
VSEL3: U7.A1(VSEL3)
NetC35_2: C35.2 U13.A15(MIC1_P/DMIC1CLK)
NetC36_2: C36.2 U13.B14(MIC1_N/DMIC1IN)
NetC37_2: C37.2 U13.D16(MIC2_P/DMIC2CLK)
NetC38_2: C38.2 U13.C15(MIC2_N/DMIC2IN)
NetC54_1: C54.1 U13.D4(VDDDIG)
NetC55_1: C55.1 U13.D2(HPCSN)
NetC59_1: C59.1 U13.C3(HPCFN)
NetC59_2: C59.2 U13.C1(HPCFP)
NetC74_1: C74.1 U13.A1(HPCSP)
NetC75_1: C75.1 U13.A7(DACREF)
NetC76_1: C76.1 U13.A9(VMID)
NetC78_1: C78.1 U13.A11(VREF)
NetR33_2: R33.2 Z5.1(EN)

Not connected (* = marked no-connect by the designer): U6 E2(NC); U7 B1(LOAD); X7 9(5) 10(6)

### Layout directives
net class SSI: SSIRXD0, SSISCK0, SSITXD0, SSIWS0
net class SDRAM_D: SDRAM_DQ0, SDRAM_DQ1, SDRAM_DQ2, SDRAM_DQ3, SDRAM_DQ4, SDRAM_DQ5, SDRAM_DQ6, SDRAM_DQ7, SDRAM_DQ8, SDRAM_DQ9, SDRAM_DQ10, SDRAM_DQ11, SDRAM_DQ12, SDRAM_DQ13, SDRAM_DQ14, SDRAM_DQ15
net class SDRAM_A: SDRAM_A1, SDRAM_A2, SDRAM_A3, SDRAM_A4, SDRAM_A5, SDRAM_A6, SDRAM_A7, SDRAM_A8, SDRAM_A9, SDRAM_A10, SDRAM_A11, SDRAM_A12, SDRAM_A13, SDRAM_A14, SDRAM_A15
net class SDRAM_C: SDRAM_CAS#, SDRAM_CKE, SDRAM_DQM0, SDRAM_DQM1, SDRAM_RAS#, SDRAM_SDCLK, SDRAM_SDCS#, SDRAM_WE#

### Notes on the sheet
- Audio CODEC
- (near U12) Quiescent Current - 0.012 mA
- VDD_IO Supply voltage:
  1.8...3.6 V
  Max power consumption:
  Stereo record
  +3V3  - 0.75 mA (Sample rate=48 kHz)
  Standby
  +3V3  - 0.003 mA
- OFF
- ON
- (near R33) I2C Address: 0x1A
- (near Z5) 2.048 Mhz
- (near C39) Supply voltage:
  1.8
  Max power consumption:
  100 uA
- (near R36) Do not populate if Z5 is mounted
- SDRAM
- SDRAM 32 MB, 4 Meg x 16 x 4 banks
- Supply voltage:
  3.0...3.6 V
  Max power consumption:
  +3V3  - 100 mA
  Standby
  +3V3  - 2.5 mA
- (P802)
- (P804)
- (P803)

### Library data of the parts
C35-C38 C54 C55 C58 C59 C64-C66 C74-C76 C78 = TMK105BJ105MV-F: as C80 on sheet Shett_3; Voltage - Rated: 25V; Part Number: TMK105BJ105MV-F; Distributor: Digi-Key; PartName: TMK105BJ105MV-F; Price: 0.22000; Tolerance: ±20%; Temperature Coefficient: X5R; Operating Temperature: -55°C ~ 85°C; Features: -; Package / Case: 0402 (1005 Metric)
C39-C44 C63 C77 = 0402B104K500CT: as C3 on sheet Sheet_2; Voltage - Rated: 50V; Part Number: 0402B104K500CT; Distributor: Digi-Key; PartName: 0402B104K500CT; Price: 0.19000; Tolerance: ±10%; Temperature Coefficient: X7R; Operating Temperature: -55°C ~ 125°C; Features: -; Package / Case: 0402 (1005 Metric)
C45-C47 C49 = CL05B103KB5NNNC: 10000pF, ±10%, 50V, X7R, 0402 (1005 Metric), -55°C ~ 125°C, -, General Purpose; Manufacturer: Samsung Electro-Mechanics; PartNum: 1276-1028-1-ND; Voltage - Rated: 50V; Part Number: CL05B103KB5NNNC; Distributor: Digi-Key; PartName: CL05B103KB5NNNC; Price: 0.10000; Tolerance: ±10%; Temperature Coefficient: X7R; Operating Temperature: -55°C ~ 125°C; Features: -; Package / Case: 0402 (1005 Metric)
C50 = GRT188R61C106KE13D: as C1 on sheet Sheet_2; Voltage - Rated: 16V; Part Number: GRT188R61C106KE13D; Distributor: Digi-Key; PartName: GRT188R61C106KE13D; Price: 0.22770; Tolerance: ±10%; Temperature Coefficient: X5R; Operating Temperature: -55°C ~ 85°C; Features: -; Package / Case: 0603 (1608 Metric)
M4 = ICS-40730: 25Hz ~ 20kHz Analog Microphone MEMS (Silicon) 1.5V ~ 3.63V Noise Cancelling (-32dB ±2dB @ 124dB SPL) Solder Pads; Manufacturer: TDK InvenSense; PartNum: 1428-1141-1-ND; Distributor: Digi-Key; PartName: ICS-40730
R33 = RMCF0402FT453R: 453 Ohms, ±1%, 0.063W, 1/16W, Thick Film, ±100ppm/°C, 0402 (1005 Metric), -55°C ~ 155°C, Automotive AEC-Q200; Manufacturer: Stackpole Electronics Inc; PartNum: RMCF0402FT453RCT-ND; Voltage: 75V; Distributor: Digi-Key; Price: 0.10000; Tolerance: ±1%; PartName: RMCF0402FT453R; Part Number: RMCF0402FT453R; Temperature Coefficient: ±100ppm/°C; Operating Temperature: -55°C ~ 155°C; Power (Watts): 0.063W, 1/16W; Features: Automotive AEC-Q200; Package / Case: 0402 (1005 Metric)
R35 = RMCF0402FT10K0: as R4 on sheet Sheet_2; Distributor: Digi-Key; Price: 0.10000; Tolerance: ±1%; PartName: RMCF0402FT10K0; Part Number: RMCF0402FT10K0; Temperature Coefficient: ±100ppm/°C; Operating Temperature: -55°C ~ 155°C; Power (Watts): 0.063W, 1/16W; Features: Automotive AEC-Q200; Package / Case: 0402 (1005 Metric)
R36 = RMCF0402FT10K0: Power (Watts): 0.063W, 1/16W; Distributor: Digi-Key; Package / Case: 0402 (1005 Metric)
U6 = MT48LC16M16A2B4-6A IT:G TR: Micron SDRAM 256M-Bit 16Mx16, 3.3V, 167MHz, 6ns, -40°C ~ +85°C, 54-VFBGA (8x8) Pb-free; Manufacturer: Micron Technology Inc.; PartNum: 340-128306-REEL; Distributor: Mouser; PartName: MT48LC16M16A2B4-6A IT:G TR; Price: 8$
U7 = TPS82740BSIPR: as U14 on sheet Shett_3; Distributor: Digi-Key; price: 2.88$; PartName: TPS82740BSIPR
U12 = NCP163AMX180TBG: LDO 1.8V, 250 mA, Vin < 5.5V, Iq < 20uA, -40..+125 C,  4-XDFN (1x1); Manufacturer: ON Semiconductor; PartNum: NCP163AMX180TBGOSCT-ND; Price: 0.29$; Distributor: Digi-Key; PartName: NCP163AMX180TBG
U13 = DA7217-00U32: Low power CODEC, 24 b, 2/2, I²C, I²S,  1.5V ~ 3.6V,  -25°C ~ 85°C, 34-WLCSP (4.57x1.98); Manufacturer: Dialog Semiconductor GmbH; PartNum: 1564-1043-1-ND; Price: 2.38$; Distributor: Digi-Key; PartName: DA7217-00U32
X7 = DF12NB(3.0)-20DS-0.5V(51): 20 Position Connector Receptacle, Center Strip Contacts Surface Mount Gold, height 2.2 mm, pitch 0.5 mm, Mated Stacking Heights 3mm; Manufacturer: Hirose Electric; PartNum: 26-DF12NB(3.0)-20DS-0.5V(51)CT-ND - Cut Tape (CT); Price: 064$; Distributor: Digi-Key; PartName: DF12NB(3.0)-20DS-0.5V(51); System: Connector
Z5 = SIT8021AC-J4-18S-2.048000D: 2.048MHz XO (Standard) LVCMOS Oscillator 1.8V Standby (Power Down) 4-UFBGA, CSPBGA, -20...+70 C; Manufacturer: SiTIME; Distributor: Rochester Electronics; Price: 0.6$; PartNum: SIT8021AC-J4-18S-2.048000D; Value: 2.048MHz; PartName: SIT8021AC-J4-18S-2.048000D

## Sheet Sheet_5.SchDoc
size A3
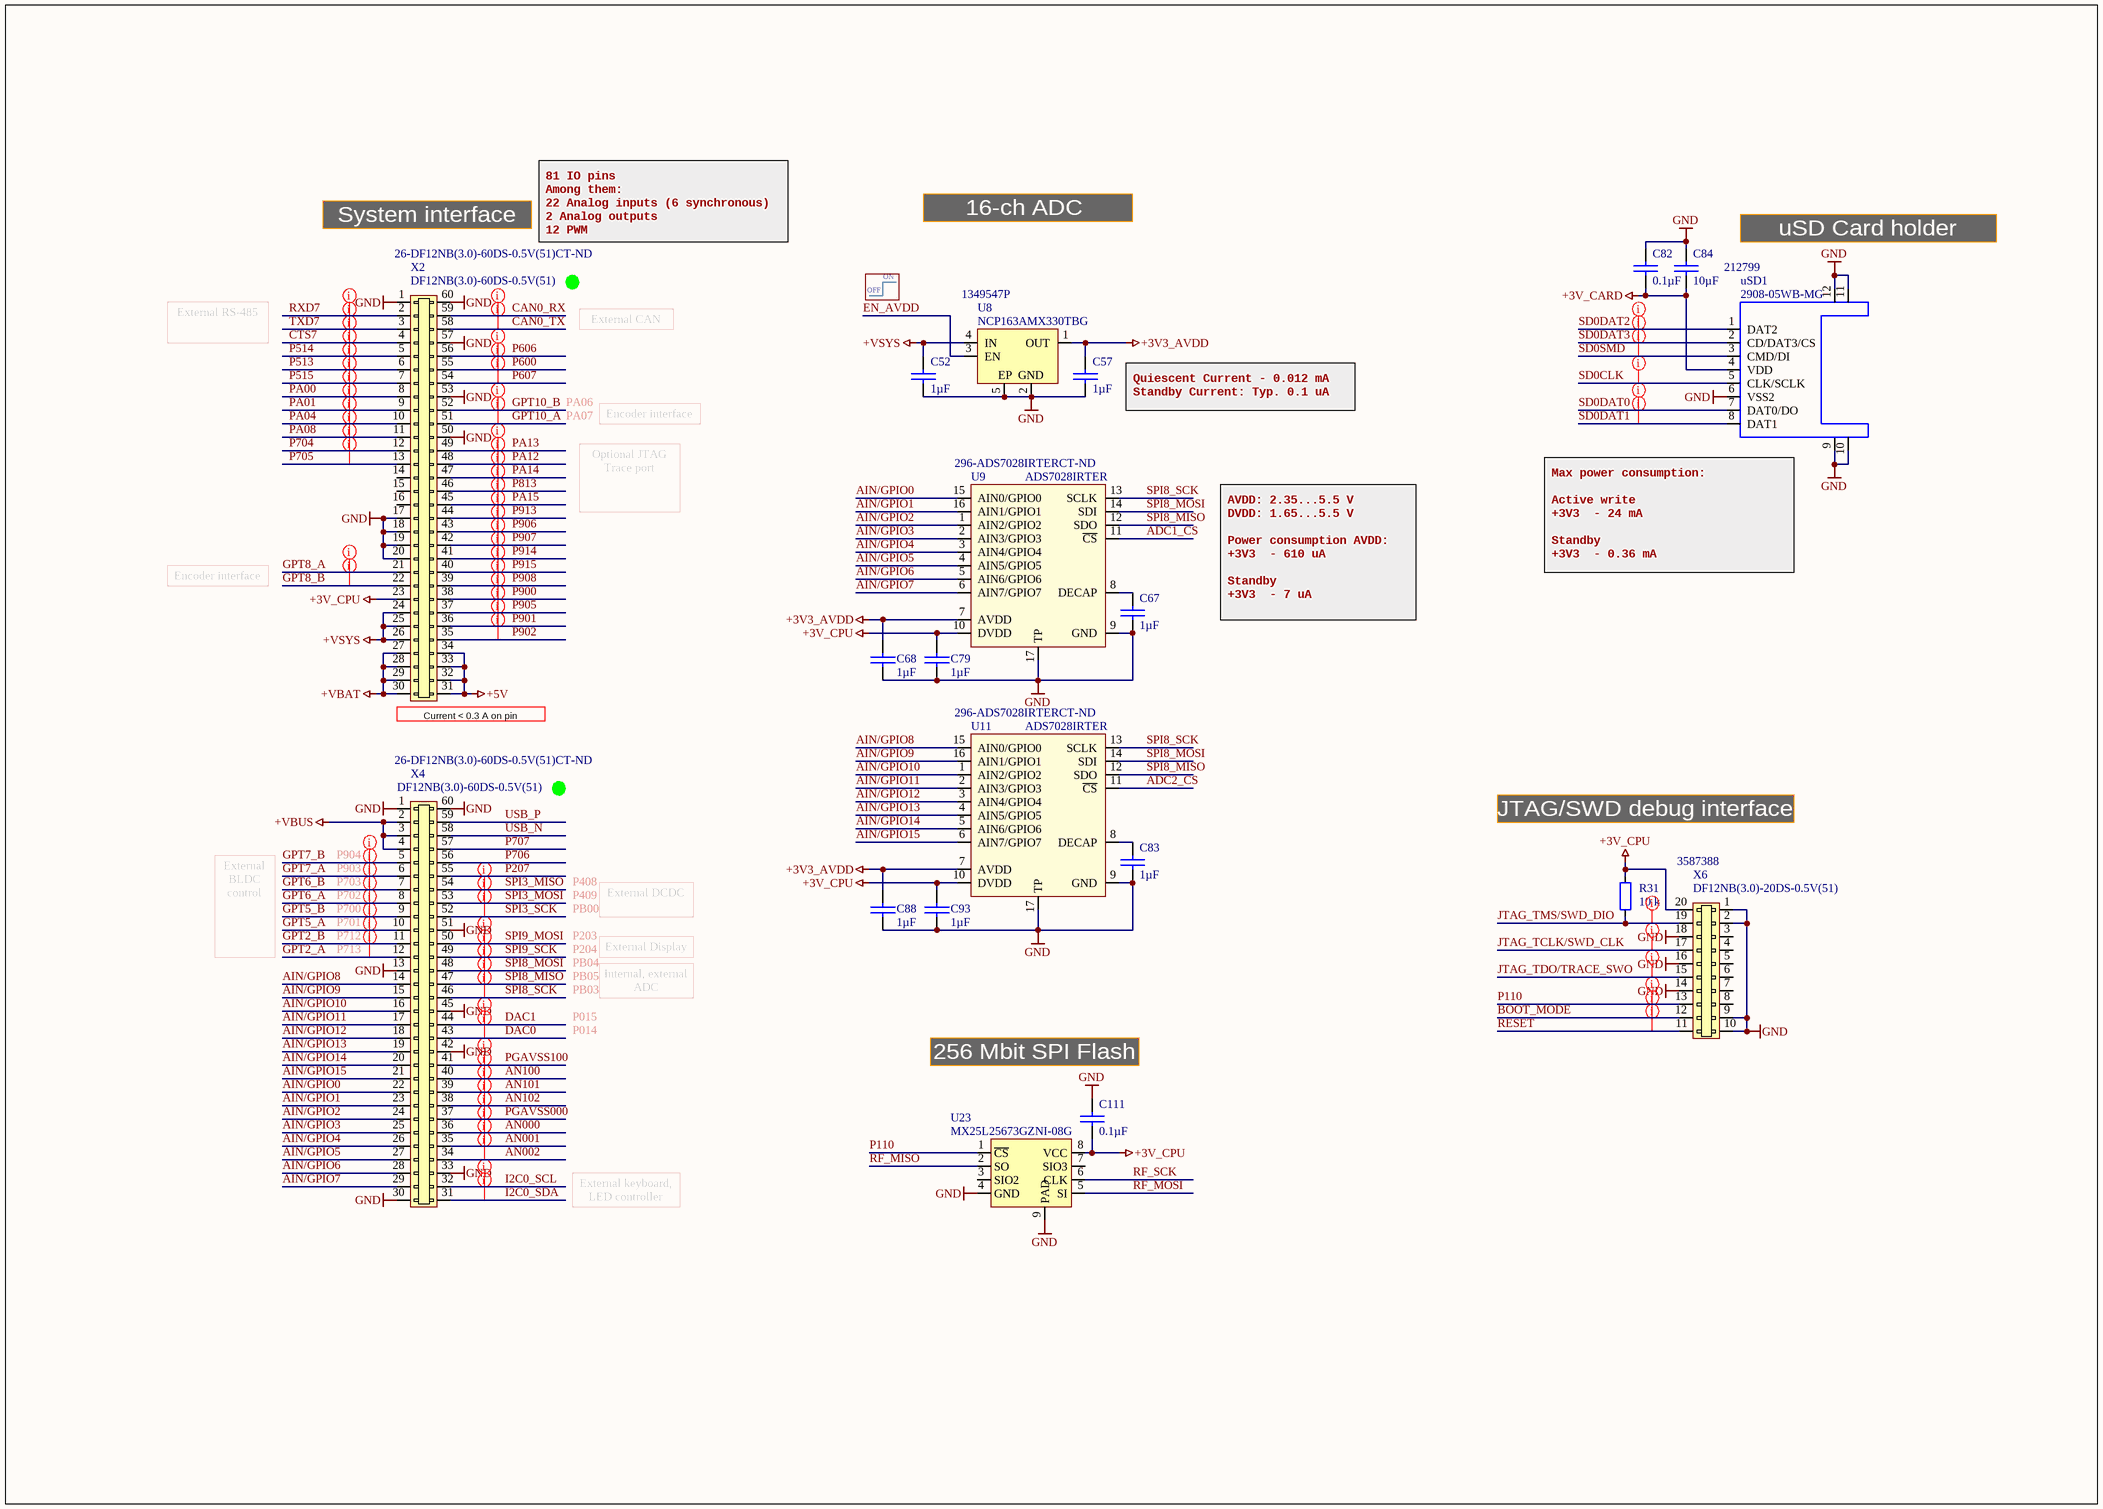
[diagram p4: Sheet_5.SchDoc]

### Parts
C52  value 1µF  [0402 CAP]  (hidden comment: TMK105BJ105MV-F)
C57  value 1µF  [0402 CAP]  (hidden comment: TMK105BJ105MV-F)
C67  value 1µF  [0402 CAP]  (hidden comment: TMK105BJ105MV-F)
C68  value 1µF  [0402 CAP]  (hidden comment: TMK105BJ105MV-F)
C79  value 1µF  [0402 CAP]  (hidden comment: TMK105BJ105MV-F)
C82  value 0.1µF  [0402 CAP]  (hidden comment: 0402B104K500CT)
C83  value 1µF  [0402 CAP]  (hidden comment: TMK105BJ105MV-F)
C84  value 10µF  [0603 CAP]  (hidden comment: GRT188R61C106KE13D)
C88  value 1µF  [0402 CAP]  (hidden comment: TMK105BJ105MV-F)
C93  value 1µF  [0402 CAP]  (hidden comment: TMK105BJ105MV-F)
C111  value 0.1µF  [0402 CAP]  (hidden comment: 0402B104K500CT)
R31  value 10 k  [0402]  (hidden comment: RMCF0402FT10K0)
U8  NCP163AMX330TBG  Supplier Part Number 1: 1349547P  [4-XDFN]
U9  ADS7028IRTER  Supplier Part Number 1: 296-ADS7028IRTERCT-ND  [WQFN-16 3x3mm TI]
U11  ADS7028IRTER  Supplier Part Number 1: 296-ADS7028IRTERCT-ND  [WQFN-16 3x3mm TI]
U23  MX25L25673GZNI-08G  [DFN8]
uSD1  2908-05WB-MG  Supplier Part Number 1: 212799  [2908-05WB-MG]
X2  DF12NB(3.0)-60DS-0.5V(51)  Supplier Part Number 1: 26-DF12NB(3.0)-60DS-0.5V(51)CT-ND  [DF12NB(3.0)-60DS-0.5V(51)]
X4  DF12NB(3.0)-60DS-0.5V(51)  Supplier Part Number 1: 26-DF12NB(3.0)-60DS-0.5V(51)CT-ND  [DF12NB(3.0)-60DS-0.5V(51)]
X6  DF12NB(3.0)-20DS-0.5V(51)  Supplier Part Number 1: 3587388  [DF12NB(3.0)-20DS-0.5V(51)]

### Nets
+3V3_AVDD: C57.1 C68.1 C88.1 U8.1(OUT) U9.7(AVDD) U11.7(AVDD)
+3V_CARD: C82.2 C84.2 uSD1.4(VDD)
+3V_CPU: C79.1 C93.1 C111.2 R31.2 U9.10(DVDD) U11.10(DVDD) U23.8(VCC) X2.23 X6.20
+5V: X2.31 X2.32 X2.33 X2.34
+VBAT: X2.27 X2.28 X2.29 X2.30
+VBUS: X4.2 X4.3 X4.4
+VSYS: C52.1 U8.4(IN) X2.24 X2.25 X2.26
GND: C52.2 C57.2 C67.2 C68.2 C79.2 C82.1 C83.2 C84.1 C88.2 C93.2 C111.1 U8.2(GND) U8.5(EP) U9.9(GND) U9.17(TP) U11.9(GND) U11.17(TP) U23.4(GND) U23.9(PAD) uSD1.6(VSS2) uSD1.9 uSD1.10(WP) uSD1.11(GND) uSD1.12(GND) X2.1 X2.17 X2.18 X2.19 X2.20 X2.50 X2.53 X2.57 X2.60 X4.1 X4.13 X4.30 X4.33 X4.42 X4.45 X4.51 X4.60 X6.1 X6.2 X6.9 X6.10 X6.14 X6.16 X6.18
ADC1_CS: U9.11(~{CS})
ADC2_CS: U11.11(~{CS})
AIN/GPIO0: U9.15(AIN0/GPIO0) X4.22
AIN/GPIO1: U9.16(AIN1/GPIO1) X4.23
AIN/GPIO2: U9.1(AIN2/GPIO2) X4.24
AIN/GPIO3: U9.2(AIN3/GPIO3) X4.25
AIN/GPIO4: U9.3(AIN4/GPIO4) X4.26
AIN/GPIO5: U9.4(AIN5/GPIO5) X4.27
AIN/GPIO6: U9.5(AIN6/GPIO6) X4.28
AIN/GPIO7: U9.6(AIN7/GPIO7) X4.29
AIN/GPIO8: U11.15(AIN0/GPIO0) X4.14
AIN/GPIO9: U11.16(AIN1/GPIO1) X4.15
AIN/GPIO10: U11.1(AIN2/GPIO2) X4.16
AIN/GPIO11: U11.2(AIN3/GPIO3) X4.17
AIN/GPIO12: U11.3(AIN4/GPIO4) X4.18
AIN/GPIO13: U11.4(AIN5/GPIO5) X4.19
AIN/GPIO14: U11.5(AIN6/GPIO6) X4.20
AIN/GPIO15: U11.6(AIN7/GPIO7) X4.21
AN000: X4.36
AN001: X4.35
AN002: X4.34
AN100: X4.40
AN101: X4.39
AN102: X4.38
BOOT_MODE: X6.12
CAN0_RX: X2.59
CAN0_TX: X2.58
CTS7: X2.4
DAC0: X4.43
DAC1: X4.44
EN_AVDD: U8.3(EN)
GPT2_A: X4.12
GPT2_B: X4.11
GPT5_A: X4.10
GPT5_B: X4.9
GPT6_A: X4.8
GPT6_B: X4.7
GPT7_A: X4.6
GPT7_B: X4.5
GPT8_A: X2.21
GPT8_B: X2.22
GPT10_A: X2.51
GPT10_B: X2.52
I2C0_SCL: X4.32
I2C0_SDA: X4.31
JTAG_TCLK/SWD_CLK: X6.17
JTAG_TDO/TRACE_SWO: X6.15
JTAG_TMS/SWD_DIO: R31.1 X6.19
P110: U23.1(~{CS}) X6.13
P207: X4.55
P513: X2.6
P514: X2.5
P515: X2.7
P600: X2.55
P606: X2.56
P607: X2.54
P704: X2.12
P705: X2.13
P706: X4.56
P707: X4.57
P813: X2.46
P900: X2.38
P901: X2.36
P902: X2.35
P905: X2.37
P906: X2.43
P907: X2.42
P908: X2.39
P913: X2.44
P914: X2.41
P915: X2.40
PA00: X2.8
PA01: X2.9
PA04: X2.10
PA08: X2.11
PA12: X2.48
PA13: X2.49
PA14: X2.47
PA15: X2.45
PGAVSS000: X4.37
PGAVSS100: X4.41
RESET: X6.11
RF_MISO: U23.2(SO)
RF_MOSI: U23.5(SI)
RF_SCK: U23.6(CLK)
RXD7: X2.2
SD0CLK: uSD1.5(CLK/SCLK)
SD0DAT0: uSD1.7(DAT0/DO)
SD0DAT1: uSD1.8(DAT1)
SD0DAT2: uSD1.1(DAT2)
SD0DAT3: uSD1.2(CD/DAT3/CS)
SD0SMD: uSD1.3(CMD/DI)
SPI3_MISO: X4.54
SPI3_MOSI: X4.53
SPI3_SCK: X4.52
SPI8_MISO: U9.12(SDO) U11.12(SDO) X4.47
SPI8_MOSI: U9.14(SDI) U11.14(SDI) X4.48
SPI8_SCK: U9.13(SCLK) U11.13(SCLK) X4.46
SPI9_MOSI: X4.50
SPI9_SCK: X4.49
TXD7: X2.3
USB_N: X4.58
USB_P: X4.59
NetC67_1: C67.1 U9.8(DECAP)
NetC83_1: C83.1 U11.8(DECAP)

Not connected (* = marked no-connect by the designer): U23 3(SIO2) 7(SIO3); X2 14 15 16; X6 3(2) 4(3) 5(3) 6(4) 7(4) 8(5)

### Layout directives
net class SWD: BOOT_MODE, JTAG_TCLK/SWD_CLK, JTAG_TDO/TRACE_SWO, JTAG_TMS/SWD_DIO, P110, RESET
net class uSD: SD0CLK, SD0DAT0, SD0DAT1, SD0DAT2, SD0DAT3, SD0SMD
net class AIN: AN000, AN001, AN002, AN100, AN101, AN102, PGAVSS000, PGAVSS100
net class I2C0: I2C0_SCL, I2C0_SDA
net class CSI8: SPI8_MISO, SPI8_MOSI, SPI8_SCK
net class CSI9: SPI9_MOSI, SPI9_SCK
net class CSI3: SPI3_MISO, SPI3_MOSI, SPI3_SCK
net class CAN0: CAN0_RX, CAN0_TX
net class CSI7: CTS7, RXD7, TXD7
net class TRACE: P813, PA12, PA13, PA14, PA15
net class MOTCTRL: GPT2_A, GPT2_B, GPT5_A, GPT5_B, GPT6_A, GPT6_B, GPT7_A, GPT7_B
net class ENCODER: GPT8_A, GPT8_B, GPT10_A, GPT10_B
net class P9: P900, P901, P902, P905, P906, P907, P908, P913, P914, P915
net class P5: P513, P514, P515
net class PA: PA00, PA01, PA04, PA08
net class P6: P600, P606, P607
net class P7: P704, P705
net class DAC: DAC0, DAC1

### Notes on the sheet
- System interface
- 81 IO pins
  Among them:
  22 Analog inputs (6 synchronous)
  2 Analog outputs
  12 PWM
- 16-ch ADC
- uSD Card holder
- OFF
- ON
- External RS-485
- External CAN
- PA06
- PA07
- Encoder interface
- (near C57) Quiescent Current - 0.012 mA
  Standby Current: Typ. 0.1 uA
- Optional JTAG Trace port
- (near uSD1) Max power consumption:
  Active write
  +3V3  - 24 mA
  Standby
  +3V3  - 0.36 mA
- AVDD: 2.35...5.5 V
  DVDD: 1.65...5.5 V
  Power consumption AVDD:
  +3V3  - 610 uA
  Standby
  +3V3  - 7 uA
- (near X2) Current < 0.3 A on pin
- (near X4) P904
- JTAG/SWD debug interface
- (near X4) P903
- (near X4) P703
- (near X4) P702
- (near X4) P700
- P408
- P409
- PB00
- External DCDC
- External BLDC control
- (near X4) P701
- (near X4) P712
- (near X4) P713
- P203
- P204
- PB04
- PB05
- PB03
- External Display
- Internal, external ADC
- P015
- P014
- (near C111) 256 Mbit SPI Flash
- External keyboard, LED controller

### Library data of the parts
C52 C57 C67 C68 C79 C83 C88 C93 = TMK105BJ105MV-F: 1µF, ±20%, 25V, X5R, 0402 (1005 Metric), -55°C ~ 85°C, -, General Purpose; Manufacturer: Taiyo Yuden; PartNum: 587-3245-1-ND; Voltage - Rated: 25V; Part Number: TMK105BJ105MV-F; Distributor: Digi-Key; PartName: TMK105BJ105MV-F; Price: 0.22000; Tolerance: ±20%; Temperature Coefficient: X5R; Operating Temperature: -55°C ~ 85°C; Features: -; Package / Case: 0402 (1005 Metric)
C82 C111 = 0402B104K500CT: 0.1µF, ±10%, 50V, X7R, 0402 (1005 Metric), -55°C ~ 125°C, -, General Purpose; Manufacturer: Walsin Technology Corporation; PartNum: 1292-1176-1-ND; Voltage - Rated: 50V; Part Number: 0402B104K500CT; Distributor: Digi-Key; PartName: 0402B104K500CT; Price: 0.19000; Tolerance: ±10%; Temperature Coefficient: X7R; Operating Temperature: -55°C ~ 125°C; Features: -; Package / Case: 0402 (1005 Metric)
C84 = GRT188R61C106KE13D: 10µF, ±10%, 16V, X5R, 0603 (1608 Metric), -55°C ~ 85°C, -, Automotive; Manufacturer: Murata Electronics North America; PartNum: 490-12317-1-ND; Voltage - Rated: 16V; Part Number: GRT188R61C106KE13D; Distributor: Digi-Key; PartName: GRT188R61C106KE13D; Price: 0.22770; Tolerance: ±10%; Temperature Coefficient: X5R; Operating Temperature: -55°C ~ 85°C; Features: -; Package / Case: 0603 (1608 Metric)
R31 = RMCF0402FT10K0: 10 kOhms, ±1%, 0.063W, 1/16W, Thick Film, ±100ppm/°C, 0402 (1005 Metric), -55°C ~ 155°C, Automotive AEC-Q200; Manufacturer: Stackpole Electronics Inc; PartNum: RMCF0402FT10K0CT-ND; Voltage: 75V; Distributor: Digi-Key; Price: 0.10000; Tolerance: ±1%; PartName: RMCF0402FT10K0; Part Number: RMCF0402FT10K0; Temperature Coefficient: ±100ppm/°C; Operating Temperature: -55°C ~ 155°C; Power (Watts): 0.063W, 1/16W; Features: Automotive AEC-Q200; Package / Case: 0402 (1005 Metric)
U8 = NCP163AMX330TBG: LDO 3.3V, 250 mA, Vin < 5.5V, Iq < 20uA, -40..+125 C,  4-XDFN (1x1); Manufacturer: ON Semiconductor; PartNum: NCP163AMX330TBGOSCT-ND; Price: 0.41$; Distributor: Digi-Key; PartName: NCP163AMX330TBG; Supplier 1: RSComponents
U9 U11 = ADS7028IRTER: 12 Bit Analog to Digital Converter 8 Input 1 SAR, 2.35V ~ 5.5V, 16-WQFN (3x3),  -40°C ~ 85°C; Manufacturer: Texas Instruments; Distributor: Digi-Key; PartNum: 296-ADS7028IRTERCT-ND; Price: 5.1$; PartName: ADS7028IRTER; Supplier 1: Digi-Key
U23 = MX25L25673GZNI-08G: FLASH - NOR Memory IC 256Mbit SPI 120 MHz, 2.7V ~ 3.6V, 8-WSON (6x5), -40°C ~ 85°C (TA); Manufacturer: Kioxia America, Inc.; PartNum: TC58CVG1S3HRAIG-ND; Price: 4.9$; Distributor: Digi-Key
uSD1 = 2908-05WB-MG: microSD cadr holder; Manufacturer: 3M; Price: 2.71$; Distributor: Farnell; PartNum: 2908-05WB-MG; PartName: 2908-05WB-MG; Supplier 1: RSComponents
X2 X4 = DF12NB(3.0)-60DS-0.5V(51): 60 Position Connector Receptacle, Center Strip Contacts Surface Mount Gold, height 2.2 mm, pitch 0.5 mm, Mated Stacking Heights 3mm; Manufacturer: Hirose Electric; Price: 1.33$; Distributor: Digi-Key; PartNum: 26-DF12NB(3.0)-60DS-0.5V(51)CT-ND; PartName: DF12NB(3.0)-60DS-0.5V(51); Supplier 1: Digi-Key; System: Connector
X6 = DF12NB(3.0)-20DS-0.5V(51): 20 Position Connector Receptacle, Center Strip Contacts Surface Mount Gold, height 2.2 mm, pitch 0.5 mm, Mated Stacking Heights 3mm; Manufacturer: Hirose Electric; PartNum: 26-DF12NB(3.0)-20DS-0.5V(51)CT-ND - Cut Tape (CT); Price: 064$; Distributor: Digi-Key; PartName: DF12NB(3.0)-20DS-0.5V(51); Supplier 1: Farnell; System: Connector

## Nets that join several sheets
+3V_CARD: Sheet_2 (U10.B1), Sheet_5 (C82.2 C84.2 uSD1.4)
+3V_CPU: Sheet_2 (43 pins), Shett_3 (9 pins), Sheet_4 (5 pins), Sheet_5 (9 pins)
+5V: Sheet_2 (10 pins), Sheet_5 (X2.31 X2.32 X2.33 X2.34)
+VBAT: Sheet_2 (7 pins), Sheet_5 (X2.27 X2.28 X2.29 X2.30)
+VBUS: Sheet_2 (C3.2 R1.1 U1.1 VD3.2), Sheet_5 (X4.2 X4.3 X4.4)
+VSYS: Sheet_2 (9 pins), Shett_3 (C101.2 U14.C3 U21.3), Sheet_4 (U7.C3), Sheet_5 (5 pins)
GND: Sheet_2 (100 pins), Shett_3 (66 pins), Sheet_4 (20 pins), Sheet_5 (48 pins)
ADC1_CS: Sheet_1 (U17.J11), Sheet_5 (U9.11)
ADC2_CS: Sheet_1 (U17.H11), Sheet_5 (U11.11)
AN000: Sheet_1 (U17.R12), Sheet_5 (X4.36)
AN001: Sheet_1 (U17.P11), Sheet_5 (X4.35)
AN002: Sheet_1 (U17.N12), Sheet_5 (X4.34)
AN100: Sheet_1 (U17.M11), Sheet_5 (X4.40)
AN101: Sheet_1 (U17.R11), Sheet_5 (X4.39)
AN102: Sheet_1 (U17.P10), Sheet_5 (X4.38)
BOOT_MODE: Sheet_2 (BT3.1 BT3.2 R7.1 U17.C8), Sheet_5 (X6.12)
BT_REG_ON: Sheet_1 (U17.P3), Shett_3 (MOD1.32)
BT_WAKE: Sheet_1 (U17.M10), Shett_3 (MOD1.47)
CAN0_RX: Sheet_1 (U17.L6), Sheet_5 (X2.59)
CAN0_TX: Sheet_1 (U17.L5), Sheet_5 (X2.58)
CARD_PWR_EN: Sheet_1 (U17.K8), Sheet_2 (U10.B2)
CHARGER_INT: Sheet_1 (U17.J5), Sheet_2 (R34.1 U3.7)
CLK32768: Sheet_2 (C62.1 U17.J14 Z4.2), Shett_3 (R39.2)
CODEC_IRQ: Sheet_1 (U17.A12), Sheet_4 (R35.1 U13.C13)
CODEC_PWR: Sheet_1 (U17.M12), Sheet_4 (U12.3)
CTS7: Sheet_1 (U17.J3), Sheet_5 (X2.4)
DAC0: Sheet_1 (U17.M9), Sheet_5 (X4.43)
DAC1: Sheet_1 (U17.M8), Sheet_5 (X4.44)
EN_AVDD: Sheet_1 (U17.G11), Sheet_5 (U8.3)
GPT2_A: Sheet_1 (U17.G10), Sheet_5 (X4.12)
GPT2_B: Sheet_1 (U17.F11), Sheet_5 (X4.11)
GPT5_A: Sheet_1 (U17.M15), Sheet_5 (X4.10)
GPT5_B: Sheet_1 (U17.M14), Sheet_5 (X4.9)
GPT6_A: Sheet_1 (U17.K11), Sheet_5 (X4.8)
GPT6_B: Sheet_1 (U17.J8), Sheet_5 (X4.7)
GPT7_A: Sheet_1 (U17.D9), Sheet_5 (X4.6)
GPT7_B: Sheet_1 (U17.C9), Sheet_5 (X4.5)
GPT8_A: Sheet_1 (U17.B7), Sheet_5 (X2.21)
GPT8_B: Sheet_1 (U17.A7), Sheet_5 (X2.22)
GPT10_A: Sheet_1 (U17.J1), Sheet_5 (X2.51)
GPT10_B: Sheet_1 (U17.J2), Sheet_5 (X2.52)
I2C0_SCL: Sheet_1 (U17.N13), Sheet_5 (X4.32)
I2C0_SDA: Sheet_1 (U17.P15), Sheet_5 (X4.31)
IMU_INT2: Sheet_1 (U17.R10), Shett_3 (U15.9)
JTAG_TCLK/SWD_CLK: Sheet_1 (U17.F5), Sheet_5 (X6.17)
JTAG_TDO/TRACE_SWO: Sheet_1 (U17.B1), Sheet_4 (R36.1), Sheet_5 (X6.15)
JTAG_TMS/SWD_DIO: Sheet_1 (U17.B2), Sheet_5 (R31.1 X6.19)
LED_B: Sheet_1 (U17.C11), Sheet_2 (R15.1)
LED_G: Sheet_1 (U17.F9), Sheet_2 (R14.1)
LED_R: Sheet_1 (U17.E10), Sheet_2 (R13.1)
LORA_PWR_EN: Sheet_1 (U17.K7), Shett_3 (U14.B3)
P110: Sheet_1 (U17.C2), Sheet_5 (U23.1 X6.13)
P207: Sheet_1 (U17.C13), Sheet_5 (X4.55)
P513: Sheet_1 (U17.P13), Sheet_5 (X2.6)
P514: Sheet_1 (U17.P14), Sheet_5 (X2.5)
P515: Sheet_1 (U17.K9), Sheet_5 (X2.7)
P600: Sheet_1 (U17.L3), Sheet_5 (X2.55)
P606: Sheet_1 (U17.K6), Sheet_5 (X2.56)
P607: Sheet_1 (U17.K5), Sheet_5 (X2.54)
P704: Sheet_1 (U17.J10), Sheet_5 (X2.12)
P705: Sheet_1 (U17.L13), Sheet_5 (X2.13)
P706: Sheet_1 (U17.L14), Sheet_5 (X4.56)
P707: Sheet_1 (U17.L15), Sheet_5 (X4.57)
P813: Sheet_1 (U17.G1), Sheet_5 (X2.46)
P900: Sheet_1 (U17.E9), Sheet_5 (X2.38)
P901: Sheet_1 (U17.B11), Sheet_5 (X2.36)
P902: Sheet_1 (U17.A11), Sheet_5 (X2.35)
P905: Sheet_1 (U17.A6), Sheet_5 (X2.37)
P906: Sheet_1 (U17.F6), Sheet_5 (X2.43)
P907: Sheet_1 (U17.F7), Sheet_5 (X2.42)
P908: Sheet_1 (U17.E7), Sheet_5 (X2.39)
P913: Sheet_1 (U17.H8), Sheet_5 (X2.44)
P914: Sheet_1 (U17.E5), Sheet_5 (X2.41)
P915: Sheet_1 (U17.E6), Sheet_5 (X2.40)
PA00: Sheet_1 (U17.J7), Sheet_5 (X2.8)
PA01: Sheet_1 (U17.J6), Sheet_5 (X2.9)
PA04: Sheet_1 (U17.J4), Sheet_5 (X2.10)
PA08: Sheet_1 (U17.G7), Sheet_5 (X2.11)
PA12: Sheet_1 (U17.G5), Sheet_5 (X2.48)
PA13: Sheet_1 (U17.H7), Sheet_5 (X2.49)
PA14: Sheet_1 (U17.G3), Sheet_5 (X2.47)
PA15: Sheet_1 (U17.G2), Sheet_5 (X2.45)
PGAVSS000: Sheet_1 (U17.L10), Sheet_5 (X4.37)
PGAVSS100: Sheet_1 (U17.L9), Sheet_5 (X4.41)
PWR_SEL: Sheet_1 (U17.G6), Sheet_2 (U3.2)
RESET: Sheet_2 (C5.1 R9.1 U4.1 U17.F8), Sheet_5 (X6.11)
RF_ANT_SW: Sheet_1 (U17.D8), Shett_3 (R45.2)
RF_BUSY: Sheet_1 (U17.H4), Shett_3 (U16.14)
RF_CS: Sheet_1 (U17.N6), Shett_3 (U16.19)
RF_DIO1: Sheet_1 (U17.H5), Shett_3 (U16.13)
RF_MISO: Sheet_1 (U17.N7), Shett_3 (U16.16), Sheet_5 (U23.2)
RF_MOSI: Sheet_1 (U17.P6), Shett_3 (U16.17), Sheet_5 (U23.5)
RF_RST: Sheet_1 (U17.E8), Shett_3 (U16.15)
RF_SCK: Sheet_1 (U17.M7), Shett_3 (U16.18), Sheet_5 (U23.6)
RTC_CS: Sheet_1 (U17.E11), Sheet_2 (U4.12)
RTC_IRQ: Sheet_1 (U17.N10), Sheet_2 (R23.2 U4.11)
RXD7: Sheet_1 (U17.N14), Sheet_5 (X2.2)
SCI1_CTS: Sheet_1 (U17.E12), Shett_3 (MOD1.46)
SCI1_RTS: Sheet_1 (U17.F10), Shett_3 (MOD1.44)
SCI1_RXD: Sheet_1 (U17.D15), Shett_3 (MOD1.43)
SCI1_TXD: Sheet_1 (U17.E13), Shett_3 (MOD1.45)
SCL2: Sheet_1 (U17.R14), Sheet_2 (R32.1 U3.5 U5.B1), Shett_3 (U15.13), Sheet_4 (U13.C11)
SD0CLK: Sheet_1 (U17.D12), Sheet_5 (uSD1.5)
SD0DAT0: Sheet_1 (U17.D14), Sheet_5 (uSD1.7)
SD0DAT1: Sheet_1 (U17.C15), Sheet_5 (uSD1.8)
SD0DAT2: Sheet_1 (U17.G9), Sheet_5 (uSD1.1)
SD0DAT3: Sheet_1 (U17.C12), Sheet_5 (uSD1.2)
SD0SMD: Sheet_1 (U17.D13), Sheet_5 (uSD1.3)
SD1CLK: Sheet_1 (U17.R4), Shett_3 (MOD1.15)
SD1DAT0: Sheet_1 (U17.N5), Shett_3 (MOD1.9)
SD1DAT1: Sheet_1 (U17.P5), Shett_3 (MOD1.10)
SD1DAT2: Sheet_1 (U17.R5), Shett_3 (MOD1.13)
SD1DAT3: Sheet_1 (U17.M5), Shett_3 (MOD1.11)
SD1SMD: Sheet_1 (U17.N4), Shett_3 (MOD1.12)
SDA2: Sheet_1 (U17.R15), Sheet_2 (R29.1 U3.6 U5.C1), Shett_3 (U15.14), Sheet_4 (U13.D12)
SDRAM_A1: Sheet_1 (U17.E3), Sheet_4 (U6.H7)
SDRAM_A2: Sheet_1 (U17.E4), Sheet_4 (U6.H8)
SDRAM_A3: Sheet_1 (U17.D3), Sheet_4 (U6.J8)
SDRAM_A4: Sheet_1 (U17.C3), Sheet_4 (U6.J7)
SDRAM_A5: Sheet_1 (U17.C1), Sheet_4 (U6.J3)
SDRAM_A6: Sheet_1 (U17.B3), Sheet_4 (U6.J2)
SDRAM_A7: Sheet_1 (U17.A2), Sheet_4 (U6.H3)
SDRAM_A8: Sheet_1 (U17.A3), Sheet_4 (U6.H2)
SDRAM_A9: Sheet_1 (U17.C4), Sheet_4 (U6.H1)
SDRAM_A10: Sheet_1 (U17.D4), Sheet_4 (U6.G3)
SDRAM_A11: Sheet_1 (U17.D5), Sheet_4 (U6.H9)
SDRAM_A12: Sheet_1 (U17.D6), Sheet_4 (U6.G2)
SDRAM_A13: Sheet_1 (U17.D7), Sheet_4 (U6.G7)
SDRAM_A14: Sheet_1 (U17.C5), Sheet_4 (U6.G8)
SDRAM_A15: Sheet_1 (U17.C6), Sheet_4 (U6.G1)
SDRAM_CAS#: Sheet_1 (U17.B6), Sheet_4 (U6.F7)
SDRAM_CKE: Sheet_1 (U17.G4), Sheet_4 (U6.F3)
SDRAM_DQ0: Sheet_1 (U17.R1), Sheet_4 (U6.A8)
SDRAM_DQ1: Sheet_1 (U17.P1), Sheet_4 (U6.B9)
SDRAM_DQ2: Sheet_1 (U17.N1), Sheet_4 (U6.B8)
SDRAM_DQ3: Sheet_1 (U17.N2), Sheet_4 (U6.C9)
SDRAM_DQ4: Sheet_1 (U17.N3), Sheet_4 (U6.C8)
SDRAM_DQ5: Sheet_1 (U17.M3), Sheet_4 (U6.D9)
SDRAM_DQ6: Sheet_1 (U17.L4), Sheet_4 (U6.D8)
SDRAM_DQ7: Sheet_1 (U17.K4), Sheet_4 (U6.E9)
SDRAM_DQ8: Sheet_1 (U17.F2), Sheet_4 (U6.E1)
SDRAM_DQ9: Sheet_1 (U17.F3), Sheet_4 (U6.D2)
SDRAM_DQ10: Sheet_1 (U17.F1), Sheet_4 (U6.D1)
SDRAM_DQ11: Sheet_1 (U17.K1), Sheet_4 (U6.C2)
SDRAM_DQ12: Sheet_1 (U17.K2), Sheet_4 (U6.C1)
SDRAM_DQ13: Sheet_1 (U17.K3), Sheet_4 (U6.B2)
SDRAM_DQ14: Sheet_1 (U17.P2), Sheet_4 (U6.B1)
SDRAM_DQ15: Sheet_1 (U17.R2), Sheet_4 (U6.A2)
SDRAM_DQM0: Sheet_1 (U17.L2), Sheet_4 (U6.E8)
SDRAM_DQM1: Sheet_1 (U17.F4), Sheet_4 (U6.F1)
SDRAM_PWR_EN: Sheet_1 (U17.P12), Sheet_4 (U7.B3)
SDRAM_RAS#: Sheet_1 (U17.C7), Sheet_4 (U6.F8)
SDRAM_SDCLK: Sheet_1 (U17.L1), Sheet_4 (U6.F2)
SDRAM_SDCS#: Sheet_1 (U17.E2), Sheet_4 (U6.G9)
SDRAM_WE#: Sheet_1 (U17.E1), Sheet_4 (U6.F9)
SPI3_MISO: Sheet_1 (U17.B15), Sheet_5 (X4.54)
SPI3_MOSI: Sheet_1 (U17.C14), Sheet_5 (X4.53)
SPI3_SCK: Sheet_1 (U17.H9), Sheet_5 (X4.52)
SPI8_MISO: Sheet_1 (U17.J12), Sheet_2 (U4.6), Sheet_5 (U9.12 U11.12 X4.47)
SPI8_MOSI: Sheet_1 (U17.H10), Sheet_2 (U4.9), Sheet_5 (U9.14 U11.14 X4.48)
SPI8_SCK: Sheet_1 (U17.K12), Sheet_2 (U4.7), Sheet_5 (U9.13 U11.13 X4.46)
SPI9_MOSI: Sheet_1 (U17.B12), Sheet_5 (X4.50)
SPI9_SCK: Sheet_1 (U17.D11), Sheet_5 (X4.49)
SSIRXD0: Sheet_1 (U17.J9), Sheet_4 (U13.C9)
SSISCK0: Sheet_1 (U17.N15), Sheet_4 (U13.D6)
SSITXD0: Sheet_1 (U17.M13), Sheet_4 (U13.C7)
SSIWS0: Sheet_1 (U17.K10), Sheet_4 (U13.D8)
SYSV_V: Sheet_1 (U17.M6), Sheet_2 (C25.1 R19.2 R21.1)
TXD7: Sheet_1 (U17.H6), Sheet_5 (X2.3)
U5V_V: Sheet_1 (U17.N11), Sheet_2 (C24.1 R18.2 R20.1)
USB_N: Sheet_2 (U1.5 U17.B14), Sheet_5 (X4.58)
USB_P: Sheet_2 (U1.6 U17.A14), Sheet_5 (X4.59)
USB_STATE: Sheet_1 (U17.A15), Sheet_2 (C4.2 R1.2 R2.1)
USBHS_STATE: Sheet_1 (U17.K13), Sheet_2 (C8.2 R3.2 R11.1)
VBUSCTRL: Sheet_1 (U17.G8), Sheet_2 (U20.C2)
VSEL1: Sheet_1 (U17.M4), Sheet_2 (U10.A3), Shett_3 (U14.A3), Sheet_4 (U7.A3)
VSEL2: Sheet_1 (U17.P4), Sheet_2 (U10.A2), Shett_3 (U14.A2), Sheet_4 (U7.A2)
VSEL3: Sheet_1 (U17.R3), Sheet_2 (U10.A1), Shett_3 (U14.A1), Sheet_4 (U7.A1)
WDT_RESET: Sheet_1 (U17.E14), Sheet_2 (U4.2)
WIFI_REG_ON: Sheet_1 (U17.R13), Shett_3 (U21.4 U22.4)

## Assembly variants
Base: not fitted R4 R12 R17 R25 R36 X1
Minimal: not fitted BT1 BT2 BT3 C1 C2 C25 C32 C33 C34 C35 C36 C37 C38 C39 C53 C54 C55 C58 C59 C63 C64 C65 C66 C70 C73 C74 C75 C76 C78 C80 C81 C85 C86 C87 C89 C90 C91 C92 C94 C95 C96 C97 C98 C100 C101 C104 C105 C111 L1 L9 L11 L12 L13 L14 L15 L17 M4 R4 R5 R6 R19 R21 R23 R24 R25 R26 R27 R28 R33 R34 R35 R36 R45 R46 U3 U4 U5 U12 U13 U14 U16 U19 U23 X1 X5 Z2 Z3 Z5